# Altium project VENTUNOQ.PrjPcb (part 10 of 18)

## Sheet AUDIO_CODEC.SchDoc: AUDIO CODEC
size A3; Author: Silvio Navaretti; CompanyName: ARDUINO; DrawnBy: Silvio Navaretti; Engineer: Silvio Navaretti; Organization: ARDUINO; SheetNumber: 47; SheetTotal: 51; RevAuthor: Silvio Navaretti
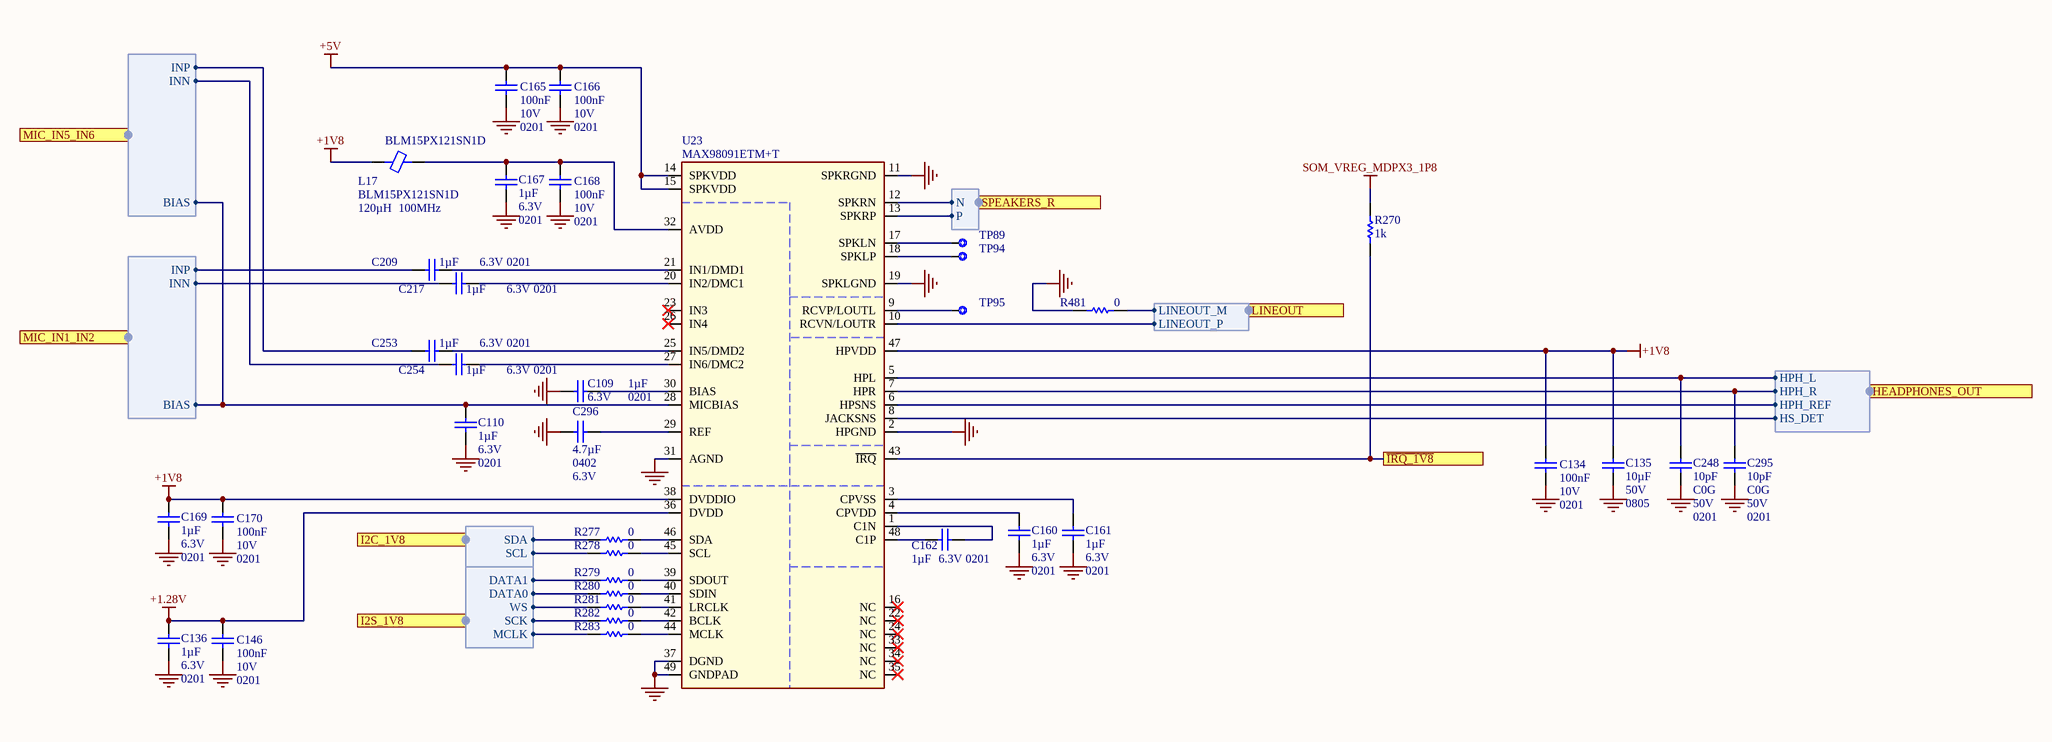
[diagram p25: AUDIO_CODEC.SchDoc]

### Parts
C109  value 1µF  Voltage: 6.3V  Case Code (Imperial): 0201  [CAP-0201]  (hidden comment: GRM033R60J105MEA2D)
C110  value 1µF  Voltage: 6.3V  Case Code (Imperial): 0201  [CAP-0201]  (hidden comment: GRM033R60J105MEA2D)
C134  value 100nF  Voltage: 10V  Case Code (Imperial): 0201  [CAP-0201]  (hidden comment: CL03A104KP3NNNC)
C135  value 10µF  Voltage: 50V  Case Code (Imperial): 0805  [CAP-0805]  (hidden comment: GRM21BR61H106ME43L)
C136  value 1µF  Voltage: 6.3V  Case Code (Imperial): 0201  [CAP-0201]  (hidden comment: GRM033R60J105MEA2D)
C146  value 100nF  Voltage: 10V  Case Code (Imperial): 0201  [CAP-0201]  (hidden comment: CL03A104KP3NNNC)
C160  value 1µF  Voltage: 6.3V  Case Code (Imperial): 0201  [CAP-0201]  (hidden comment: GRM033R60J105MEA2D)
C161  value 1µF  Voltage: 6.3V  Case Code (Imperial): 0201  [CAP-0201]  (hidden comment: GRM033R60J105MEA2D)
C162  value 1µF  Voltage: 6.3V  Case Code (Imperial): 0201  [CAP-0201]  (hidden comment: GRM033R60J105MEA2D)
C165  value 100nF  Voltage: 10V  Case Code (Imperial): 0201  [CAP-0201]  (hidden comment: CL03A104KP3NNNC)
C166  value 100nF  Voltage: 10V  Case Code (Imperial): 0201  [CAP-0201]  (hidden comment: CL03A104KP3NNNC)
C167  value 1µF  Voltage: 6.3V  Case Code (Imperial): 0201  [CAP-0201]  (hidden comment: GRM033R60J105MEA2D)
C168  value 100nF  Voltage: 10V  Case Code (Imperial): 0201  [CAP-0201]  (hidden comment: CL03A104KP3NNNC)
C169  value 1µF  Voltage: 6.3V  Case Code (Imperial): 0201  [CAP-0201]  (hidden comment: GRM033R60J105MEA2D)
C170  value 100nF  Voltage: 10V  Case Code (Imperial): 0201  [CAP-0201]  (hidden comment: CL03A104KP3NNNC)
C209  value 1µF  Voltage: 6.3V  Case Code (Imperial): 0201  [CAP-0201]  (hidden comment: GRM033R60J105MEA2D)
C217  value 1µF  Voltage: 6.3V  Case Code (Imperial): 0201  [CAP-0201]  (hidden comment: GRM033R60J105MEA2D)
C248  value 10pF  Dielectric: C0G  Voltage: 50V  Case Code (Imperial): 0201  [CAP-0201]  (hidden comment: CC0201GRNPO9BN100)
C253  value 1µF  Voltage: 6.3V  Case Code (Imperial): 0201  [CAP-0201]  (hidden comment: GRM033R60J105MEA2D)
C254  value 1µF  Voltage: 6.3V  Case Code (Imperial): 0201  [CAP-0201]  (hidden comment: GRM033R60J105MEA2D)
C295  value 10pF  Dielectric: C0G  Voltage: 50V  Case Code (Imperial): 0201  [CAP-0201]  (hidden comment: CC0201GRNPO9BN100)
C296  value 4.7µF  Case Code (Imperial): 0402  Voltage: 6.3V  [CAP-0402]  (hidden comment: C1005A475M6R3NT)
L17  BLM15PX121SN1D  Inductance: 120µH  Test Frequency: 100MHz  [L-0402]
R270  value 1k  [RES-0201]  (hidden comment: RC0201FR-071KL)
R277  value 0  [RES-0201]  (hidden comment: CRCW02010000Z0ED)
R278  value 0  [RES-0201]  (hidden comment: CRCW02010000Z0ED)
R279  value 0  [RES-0201]  (hidden comment: CRCW02010000Z0ED)
R280  value 0  [RES-0201]  (hidden comment: CRCW02010000Z0ED)
R281  value 0  [RES-0201]  (hidden comment: CRCW02010000Z0ED)
R282  value 0  [RES-0201]  (hidden comment: CRCW02010000Z0ED)
R283  value 0  [RES-0201]  (hidden comment: CRCW02010000Z0ED)
R481  value 0  [RES-0201]  (hidden comment: CRCW02010000Z0ED)
TP89  Test point 1.00mm  [TP-1.00MM]  (value not drawn)  (no BOM)
TP94  Test point 1.00mm  [TP-1.00MM]  (value not drawn)  (no BOM)
TP95  Test point 1.00mm  [TP-1.00MM]  (value not drawn)  (no BOM)
U23  MAX98091ETM+T  [QFN127P600-8N]

### Ports
HEADPHONES_OUT (harness HEADPHONES), I2C_1V8 (harness I2C), I2S_1V8 (harness SOM_MD_I2S_QUA), LINEOUT (harness LINEOUT), MIC_IN1_IN2 (harness MIC), MIC_IN5_IN6 (harness MIC), SPEAKERS_R (harness SPEAKERS), ~{IRQ_1V8}

### Harnesses
I2C: SDA, SCL
HEADPHONES: HPH_L, HPH_R, HPH_REF, HS_DET
MIC: INP, INN, BIAS
SPEAKERS: N, P
SOM_MD_I2S_QUA: SCK, WS, DATA0, DATA1, MCLK
LINEOUT: LINEOUT_P, LINEOUT_M

### Nets
+1.28V: C136.2 C146.2 U23.36(DVDD)
+1V8: C134.2 C135.1 C169.2 C170.2 L17.1 U23.38(DVDDIO) U23.47(HPVDD)
+5V: C165.2 C166.2 U23.14(SPKVDD) U23.15(SPKVDD)
GND: C109.1 C110.1 C134.1 C135.2 C136.1 C146.1 C160.1 C161.1 C165.1 C166.1 C167.1 C168.1 C169.1 C170.1 C248.1 C295.1 C296.2 R481.1 U23.2(HPGND) U23.11(SPKRGND) U23.19(SPKLGND) U23.31(AGND) U23.37(DGND) U23.49(GNDPAD)
SOM_VREG_MDPX3_1P8: R270.2
MD_GPIO_16: R270.1 U23.43(~{IRQ}) ; port ~{IRQ_1V8}
MD_GPIO_45: R277.1 ; port I2C_1V8.SDA
MD_GPIO_46: R278.1 ; port I2C_1V8.SCL
MD_LPASS_GPIO_110: R282.1 ; port I2S_1V8.SCK
MD_LPASS_GPIO_111: R281.1 ; port I2S_1V8.WS
MD_LPASS_GPIO_112: R280.1 ; port I2S_1V8.DATA0
MD_LPASS_GPIO_113: R279.1 ; port I2S_1V8.DATA1
MD_LPASS_GPIO_115: R283.1 ; port I2S_1V8.MCLK
MIC_IN5_IN6.BIAS: C110.2 U23.28(MICBIAS) ; port MIC_IN1_IN2.BIAS, port MIC_IN5_IN6.BIAS
MIC_IN5_IN6.INN: C254.2 ; port MIC_IN5_IN6.INN
MIC_IN5_IN6.INP: C253.2 ; port MIC_IN5_IN6.INP
NetC109_2: C109.2 U23.30(BIAS)
NetC160_2: C160.2 U23.4(CPVDD)
NetC161_2: C161.2 U23.3(CPVSS)
NetC162_1: C162.1 U23.1(C1N)
NetC162_2: C162.2 U23.48(C1P)
NetC167_2: C167.2 C168.2 L17.2 U23.32(AVDD)
NetC209_1: C209.1 U23.21(IN1/DMD1)
NetC209_2: C209.2 ; port MIC_IN1_IN2.INP
NetC217_1: C217.1 U23.20(IN2/DMC1)
NetC217_2: C217.2 ; port MIC_IN1_IN2.INN
NetC248_2: C248.2 U23.5(HPL) ; port HEADPHONES_OUT.HPH_L
NetC253_1: C253.1 U23.25(IN5/DMD2)
NetC254_1: C254.1 U23.27(IN6/DMC2)
NetC295_2: C295.2 U23.7(HPR) ; port HEADPHONES_OUT.HPH_R
NetC296_1: C296.1 U23.29(REF)
NetD103_1: U23.13(SPKRP) ; port SPEAKERS_R.P
NetD103_2: U23.12(SPKRN) ; port SPEAKERS_R.N
NetD103_4: U23.10(RCVN/LOUTR) ; port LINEOUT.LINEOUT_P
NetD103_5: R481.2 ; port LINEOUT.LINEOUT_M
NetD104_4: U23.6(HPSNS) ; port HEADPHONES_OUT.HPH_REF
NetD104_5: U23.8(JACKSNS) ; port HEADPHONES_OUT.HS_DET
NetR277_2: R277.2 U23.46(SDA)
NetR278_2: R278.2 U23.45(SCL)
NetR279_2: R279.2 U23.39(SDOUT)
NetR280_2: R280.2 U23.40(SDIN)
NetR281_2: R281.2 U23.41(LRCLK)
NetR282_2: R282.2 U23.42(BCLK)
NetR283_2: R283.2 U23.44(MCLK)
NetTP89_X: TP89.X U23.17(SPKLN)
NetTP94_X: TP94.X U23.18(SPKLP)
NetTP95_X: TP95.X U23.9(RCVP/LOUTL)

Not connected (* = marked no-connect by the designer): U23 16(NC)* 22(NC)* 23(IN3)* 24(NC)* 26(IN4)* 33(NC)* 34(NC)* 35(NC)*

### Notes on the sheet
- Title:
- ID:
- Date:
- Time:
- Version:
- Sheet
- of
- RevAuthor:
- Reference Designs ARE PROVIDED "AS IS" AND "WITH ALL FAULTS. Arduino SA DISCLAIMS ALL OTHER WARRANTIES, EXPRESS OR IMPLIED, REGARDING PRODUCTS, INCLUDING BUT NOT LIMITED TO, ANY IMPLIED WARRANTIES OF MERCHANTABILITY OR FITNESS FOR A PARTICULAR PURPOSE.
  Arduino SA may make changes to specifications and product descriptions at any time, without notice. The Customer must not rely on the absence or characteristics of any features or instructions marked "reserved" or "undefined".
  Arduino SA reserves these for future definition and shall have no responsibility whatsoever for conflicts or incompatibilities arising from future changes to them. The product information on the Web Site or Materials is subject to change without notice.
  Do not finalize a design with this info. ARDUINO and other Arduino brands and logos and Trademarks of Arduino SA. All Arduino SA Trademarks cannot be used without owner's formal permission.
- File:
- Author:

### Library data of the parts
C109 C110 C136 C160-C162 C167 C169 C209 C217 C253 C254 = C0002-A.15: CAP CHIP 0201 1uF 20% 6.3V X5R; Manufacturer: Murata; Code Arduino: A5520; Tolerance: 20%; Dielectric: X5R; Part Number: GRM033R60J105MEA2D; Technology: Ceramic
C134 C146 C165 C166 C168 C170 = C0113-A.6: CAP CHIP 0201 100nF 10% 10V X5R; Manufacturer: Samsung Electro-Mechanics; Code Arduino: C0113; Technology: Ceramic; Part Number: CL03A104KP3NNNC; Dielectric: X5R; Tolerance: 10%
C135 = C0158-A.3: CAP CHIP 0805 10uF 20% 50V X5R; Manufacturer: Murata Electronics; Code Arduino: C0158; Technology: SMD; Dielectric: X5R; Tolerance: 20%; Part Number: GRM21BR61H106ME43L
C248 C295 = C0144-A.3: CAP CHIP 0201 10pF 5% 50V C0G; Manufacturer: Yageo; Code Arduino: C0144; Price: 0.005; Technology: Ceramic; Tolerance: 5%; Part Number: CC0201GRNPO9BN100
C296 = C0037-A.14: CAP CHIP 0402 4.7uF 20% 6V3 X5R; Manufacturer: Hottech; Code Arduino: 0833; Dielectric: X5R; Technology: Ceramic; Part Number: C1005A475M6R3NT; Manufacturer 2: Samsung Electro-Mechanics; Tolerance: 20%; Manufacturer 3: Murata Electronics; Part number 3: GRM155R60J475ME47D; Part number 2: CL05A475KQ5NRNC
L17 = I0028-A.10: FERRITE SMD 0402 120Ohm 25% 100MHz Ferrite 2A; Manufacturer: Murata; DC Resistance (DCR): 55mR; Code Arduino: I0028; Value: 120µH; Device Type: Ferrite; Packaging: Tape and Reel; Case Code (Imperial): 0402; Max DC Current: 2A; Case Code (Metric): 1005; Package Quantity: 10000; Current: 2A; Max Operating Temperature: 125°C; Tolerance: 25%; Min Operating Temperature: -55°C; Part Number: BLM15PX121SN1D
R270 = R0195-A.22: RES CHIP 0201 1k 1% 1/20W; Manufacturer: Yageo; Power: 50mW; Temperature coefficient: 200ppm; Code Arduino: R0195; Tolerance: 1%; Case Code (Imperial): 0201; Part Number: RC0201FR-071KL; Technology: Thick film
R277-R283 R481 = R0140-A.21: RES CHIP 0201 0R; Manufacturer: Vishay; Temperature coefficient: 0ppm; Code Arduino: R0140; Power: 50mW; Tolerance: 0%; Technology: Thick film; Case Code (Imperial): 0201; Part Number: CRCW02010000Z0ED
TP89 TP94 TP95 = UT0013-A.6: Part Number: This is not a component; Design Item ID: CMP-018-0005-A.3; Source: ut.SchLib; Manufacturer: This is not a component; Code Arduino: This is not a component; Pin Count: 1
U23 = U0313-A.5: CODEC Audio CODEC, 4 IN microphone, stereo speaker out 3.2W, stereo headphone out, line output, I2C+I2S, QFN48 6x6; Manufacturer: Analog Devices; Code Arduino: U0313; Part Number: MAX98091ETM+T

## Sheet HEADERS_JHAT.SchDoc: HEADERS JHAT
size A3; Author: Silvio Navaretti; CompanyName: ARDUINO; DrawnBy: Silvio Navaretti; Engineer: Silvio Navaretti; Organization: ARDUINO; SheetNumber: 20; SheetTotal: 51; RevAuthor: Silvio Navaretti
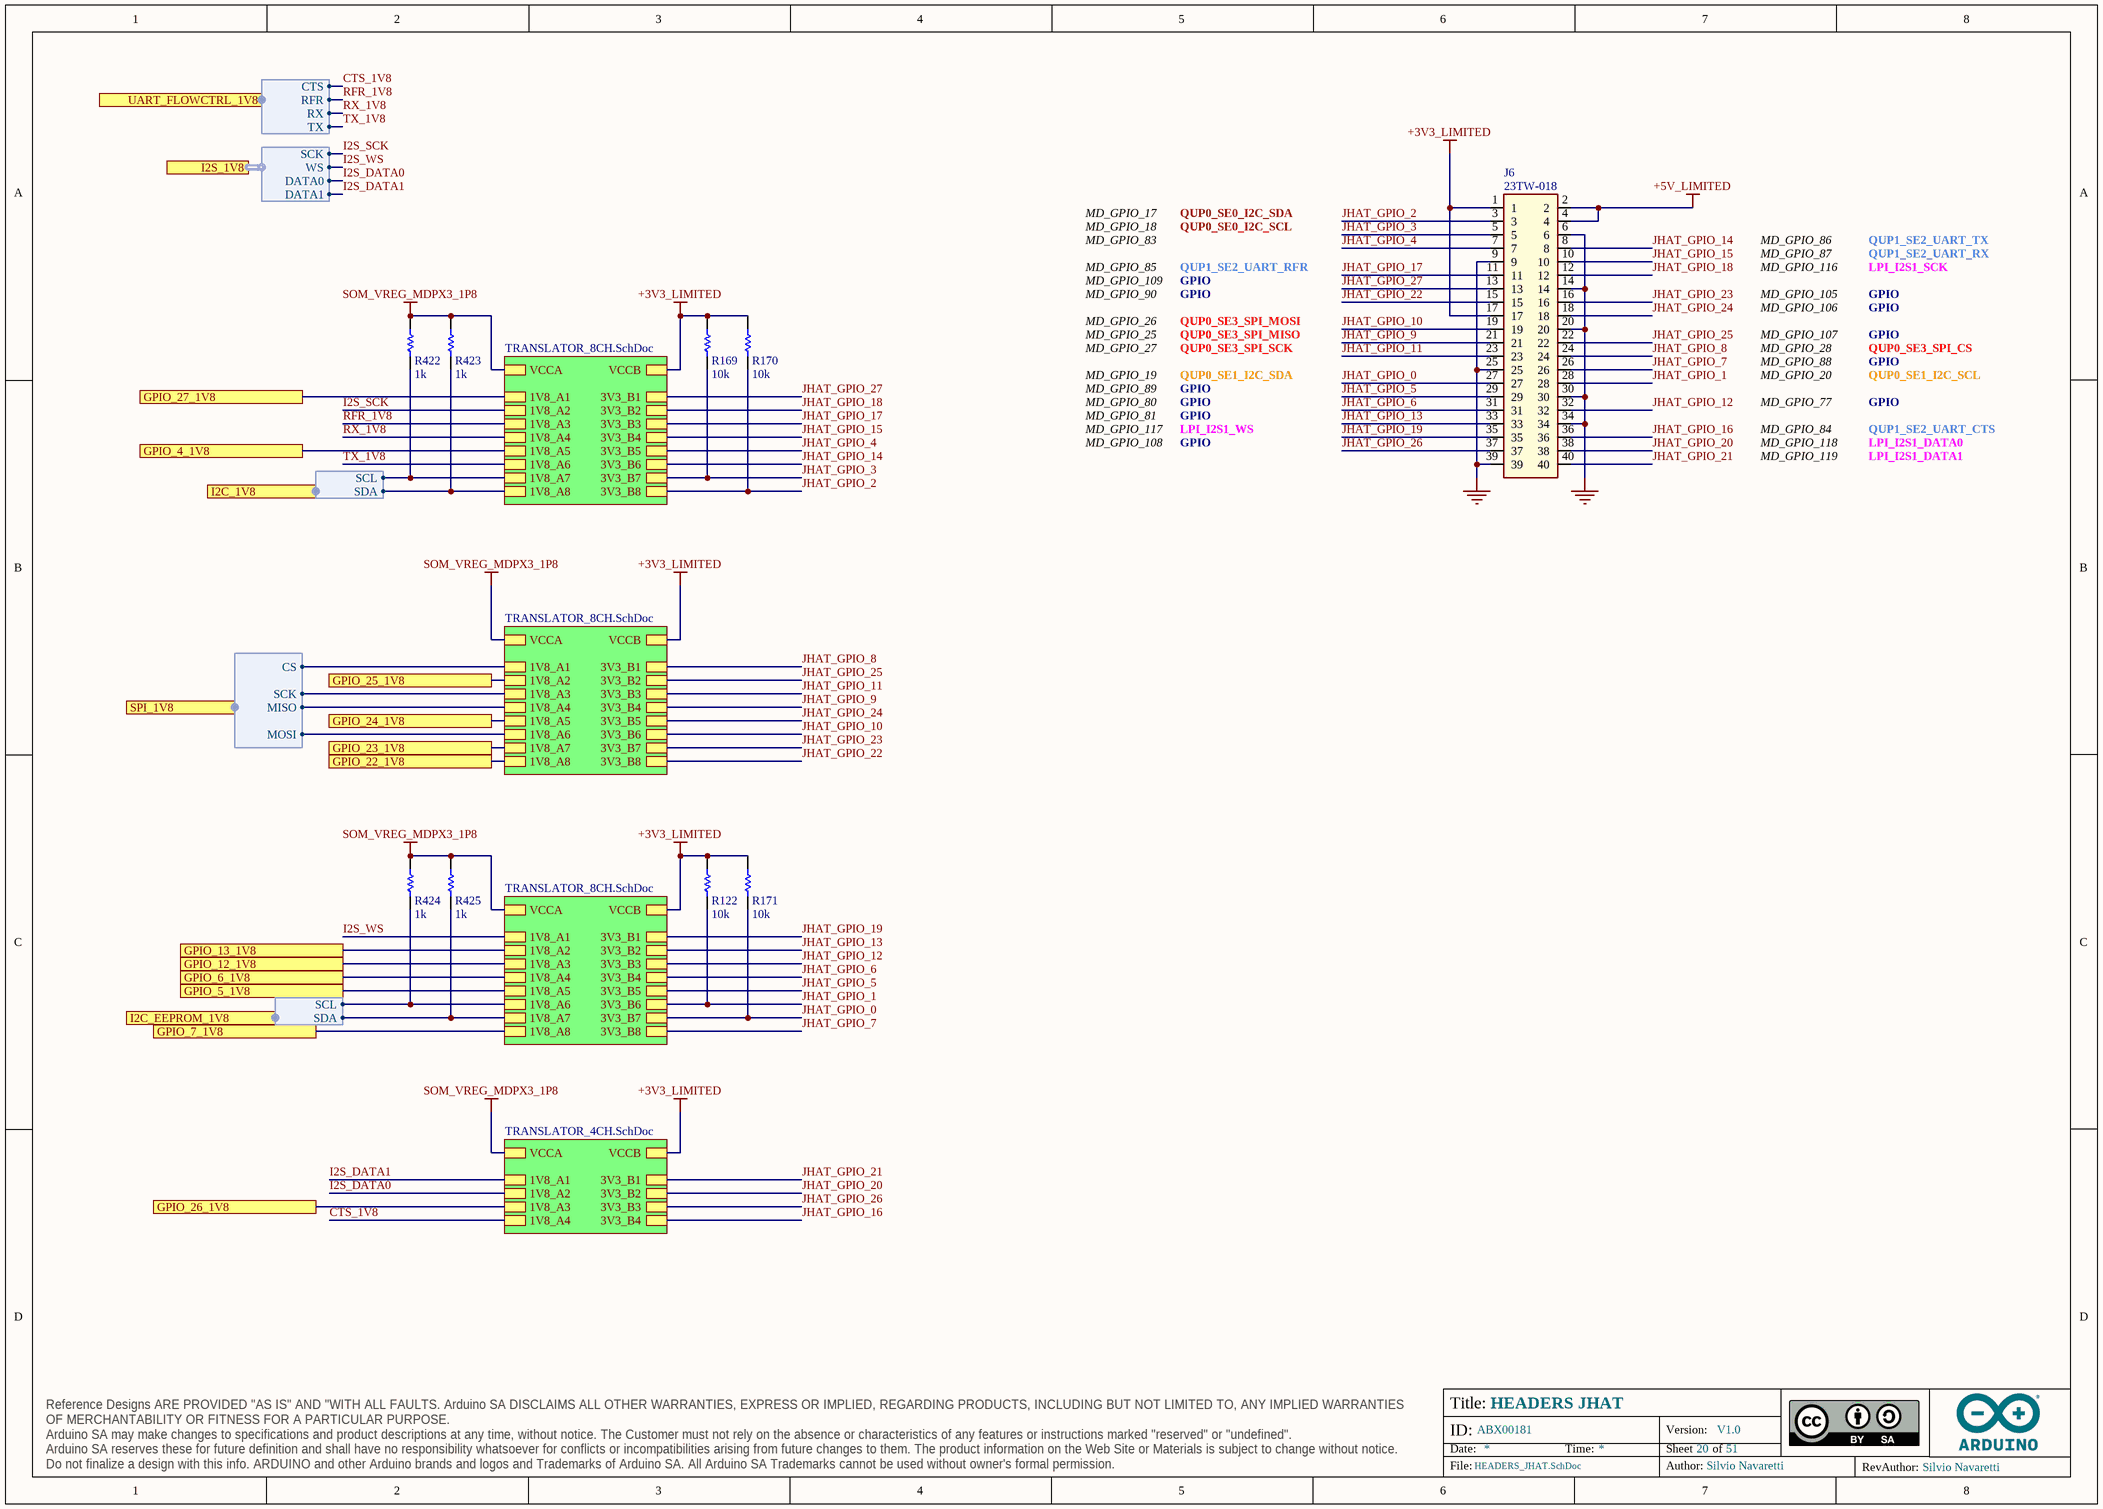
[diagram p26: HEADERS_JHAT.SchDoc]

### Parts
J6  23TW-018  [23TW-018]
R122  value 10k  [RES-0201]  (hidden comment: RC0201FR-0710KL)
R169  value 10k  [RES-0201]  (hidden comment: RC0201FR-0710KL)
R170  value 10k  [RES-0201]  (hidden comment: RC0201FR-0710KL)
R171  value 10k  [RES-0201]  (hidden comment: RC0201FR-0710KL)
R422  value 1k  [RES-0201]  (hidden comment: RC0201FR-071KL)
R423  value 1k  [RES-0201]  (hidden comment: RC0201FR-071KL)
R424  value 1k  [RES-0201]  (hidden comment: RC0201FR-071KL)
R425  value 1k  [RES-0201]  (hidden comment: RC0201FR-071KL)

### Sub-sheets
T8CH_ = TRANSLATOR_8CH.SchDoc: 1V8_A1, 1V8_A2, 1V8_A3, 1V8_A4, 1V8_A5, 1V8_A6, 1V8_A7, 1V8_A8, 3V3_B1, 3V3_B2, 3V3_B3, 3V3_B4, 3V3_B5, 3V3_B6, 3V3_B7, VCCA, VCCB, 3V3_B8
T8CH_ = TRANSLATOR_8CH.SchDoc: 1V8_A1, 1V8_A2, 1V8_A3, 1V8_A4, 1V8_A5, 1V8_A6, 1V8_A7, 1V8_A8, 3V3_B1, 3V3_B2, 3V3_B3, 3V3_B4, 3V3_B5, 3V3_B6, 3V3_B7, 3V3_B8, VCCA, VCCB
T8CH_ = TRANSLATOR_8CH.SchDoc: 1V8_A1, 1V8_A2, 1V8_A3, 1V8_A4, 1V8_A5, 1V8_A6, 1V8_A7, 1V8_A8, 3V3_B1, 3V3_B2, 3V3_B3, 3V3_B4, 3V3_B5, 3V3_B6, 3V3_B7, 3V3_B8, VCCA, VCCB
U_TRANSLATOR_4CH = TRANSLATOR_4CH.SchDoc: 1V8_A1, 1V8_A2, 1V8_A3, 1V8_A4, 3V3_B1, 3V3_B2, 3V3_B3, 3V3_B4, VCCA, VCCB

### Ports
GPIO_4_1V8, GPIO_5_1V8, GPIO_6_1V8, GPIO_7_1V8, GPIO_12_1V8, GPIO_13_1V8, GPIO_22_1V8, GPIO_23_1V8, GPIO_24_1V8, GPIO_25_1V8, GPIO_26_1V8, GPIO_27_1V8, I2C_1V8 (harness I2C), I2C_EEPROM_1V8 (harness I2C), I2S_1V8 (harness SOM_MD_I2S), SPI_1V8 (harness SPI), UART_FLOWCTRL_1V8 (harness SOM_MD_UART_FLCRTL)

### Harnesses
I2C: SDA, SCL
SPI: SCK, MISO, MOSI, CS
SOM_MD_UART_FLCRTL: TX, CTS, RFR, RX
SOM_MD_I2S: SCK, WS, DATA0, DATA1

### Nets
+3V3_LIMITED: J6.1 J6.17 R122.1 R169.1 R170.1 R171.1 ; sheet T8CH_/VCCB, sheet T8CH_/VCCB, sheet T8CH_/VCCB, sheet U_TRANSLATOR_4CH/VCCB
+5V_LIMITED: J6.2 J6.4
GND: J6.6 J6.9 J6.14 J6.20 J6.25 J6.30 J6.34 J6.39
SOM_VREG_MDPX3_1P8: R422.1 R423.1 R424.1 R425.1 ; sheet T8CH_/VCCA, sheet T8CH_/VCCA, sheet T8CH_/VCCA, sheet U_TRANSLATOR_4CH/VCCA
CTS_1V8: sheet U_TRANSLATOR_4CH/1V8_A4, port UART_FLOWCTRL_1V8.CTS
I2S_DATA0: sheet U_TRANSLATOR_4CH/1V8_A2, port I2S_1V8.DATA0
I2S_DATA1: sheet U_TRANSLATOR_4CH/1V8_A1, port I2S_1V8.DATA1
I2S_SCK: sheet T8CH_/1V8_A2, port I2S_1V8.SCK
I2S_WS: sheet T8CH_/1V8_A1, port I2S_1V8.WS
JHAT_GPIO_0: J6.27 R171.2 ; sheet T8CH_/3V3_B7
JHAT_GPIO_1: J6.28 R122.2 ; sheet T8CH_/3V3_B6
JHAT_GPIO_2: J6.3 R170.2 ; sheet T8CH_/3V3_B8
JHAT_GPIO_3: J6.5 R169.2 ; sheet T8CH_/3V3_B7
JHAT_GPIO_4: J6.7 ; sheet T8CH_/3V3_B5
JHAT_GPIO_5: J6.29 ; sheet T8CH_/3V3_B5
JHAT_GPIO_6: J6.31 ; sheet T8CH_/3V3_B4
JHAT_GPIO_7: J6.26 ; sheet T8CH_/3V3_B8
JHAT_GPIO_8: J6.24 ; sheet T8CH_/3V3_B1
JHAT_GPIO_9: J6.21 ; sheet T8CH_/3V3_B4
JHAT_GPIO_10: J6.19 ; sheet T8CH_/3V3_B6
JHAT_GPIO_11: J6.23 ; sheet T8CH_/3V3_B3
JHAT_GPIO_12: J6.32 ; sheet T8CH_/3V3_B3
JHAT_GPIO_13: J6.33 ; sheet T8CH_/3V3_B2
JHAT_GPIO_14: J6.8 ; sheet T8CH_/3V3_B6
JHAT_GPIO_15: J6.10 ; sheet T8CH_/3V3_B4
JHAT_GPIO_16: J6.36 ; sheet U_TRANSLATOR_4CH/3V3_B4
JHAT_GPIO_17: J6.11 ; sheet T8CH_/3V3_B3
JHAT_GPIO_18: J6.12 ; sheet T8CH_/3V3_B2
JHAT_GPIO_19: J6.35 ; sheet T8CH_/3V3_B1
JHAT_GPIO_20: J6.38 ; sheet U_TRANSLATOR_4CH/3V3_B2
JHAT_GPIO_21: J6.40 ; sheet U_TRANSLATOR_4CH/3V3_B1
JHAT_GPIO_22: J6.15 ; sheet T8CH_/3V3_B8
JHAT_GPIO_23: J6.16 ; sheet T8CH_/3V3_B7
JHAT_GPIO_24: J6.18 ; sheet T8CH_/3V3_B5
JHAT_GPIO_25: J6.22 ; sheet T8CH_/3V3_B2
JHAT_GPIO_26: J6.37 ; sheet U_TRANSLATOR_4CH/3V3_B3
JHAT_GPIO_27: J6.13 ; sheet T8CH_/3V3_B1
MD_GPIO_17: R423.2 ; sheet T8CH_/1V8_A8, port I2C_1V8.SDA
MD_GPIO_18: R422.2 ; sheet T8CH_/1V8_A7, port I2C_1V8.SCL
MD_GPIO_19: R425.2 ; sheet T8CH_/1V8_A7, port I2C_EEPROM_1V8.SDA
MD_GPIO_20: R424.2 ; sheet T8CH_/1V8_A6, port I2C_EEPROM_1V8.SCL
MD_GPIO_25: sheet T8CH_/1V8_A4, port SPI_1V8.MISO
MD_GPIO_26: sheet T8CH_/1V8_A6, port SPI_1V8.MOSI
MD_GPIO_27: sheet T8CH_/1V8_A3, port SPI_1V8.SCK
MD_GPIO_28: sheet T8CH_/1V8_A1, port SPI_1V8.CS
MD_GPIO_77: port GPIO_12_1V8, sheet T8CH_/1V8_A3
MD_GPIO_80: port GPIO_6_1V8, sheet T8CH_/1V8_A4
MD_GPIO_81: port GPIO_13_1V8, sheet T8CH_/1V8_A2
MD_GPIO_83: port GPIO_4_1V8, sheet T8CH_/1V8_A5
MD_GPIO_88: port GPIO_7_1V8, sheet T8CH_/1V8_A8
MD_GPIO_89: port GPIO_5_1V8, sheet T8CH_/1V8_A5
MD_GPIO_90: port GPIO_22_1V8, sheet T8CH_/1V8_A8
MD_GPIO_105: port GPIO_23_1V8, sheet T8CH_/1V8_A7
MD_GPIO_106: port GPIO_24_1V8, sheet T8CH_/1V8_A5
MD_GPIO_107: port GPIO_25_1V8, sheet T8CH_/1V8_A2
MD_GPIO_108: port GPIO_26_1V8, sheet U_TRANSLATOR_4CH/1V8_A3
MD_GPIO_109: port GPIO_27_1V8, sheet T8CH_/1V8_A1
RFR_1V8: sheet T8CH_/1V8_A3, port UART_FLOWCTRL_1V8.RFR  [project net MD_GPIO_85]
RX_1V8: sheet T8CH_/1V8_A4, port UART_FLOWCTRL_1V8.RX  [project net MD_GPIO_87]
TX_1V8: sheet T8CH_/1V8_A6, port UART_FLOWCTRL_1V8.TX  [project net MD_GPIO_86]

### Notes on the sheet
- MD_GPIO_17
- MD_GPIO_18
- MD_GPIO_83
- QUP0_SE0_I2C_SDA
- QUP0_SE0_I2C_SCL
- MD_GPIO_86
- QUP1_SE2_UART_TX
- MD_GPIO_85
- MD_GPIO_109
- MD_GPIO_90
- QUP1_SE2_UART_RFR
- GPIO
- MD_GPIO_87
- MD_GPIO_116
- MD_GPIO_105
- MD_GPIO_106
- QUP1_SE2_UART_RX
- LPI_I2S1_SCK
- MD_GPIO_26
- MD_GPIO_25
- MD_GPIO_27
- MD_GPIO_19
- QUP0_SE3_SPI_MOSI
- QUP0_SE3_SPI_MISO
- QUP0_SE3_SPI_SCK
- QUP0_SE1_I2C_SDA
- MD_GPIO_107
- MD_GPIO_28
- MD_GPIO_88
- MD_GPIO_20
- QUP0_SE3_SPI_CS
- QUP0_SE1_I2C_SCL
- MD_GPIO_89
- MD_GPIO_80
- MD_GPIO_81
- MD_GPIO_117
- MD_GPIO_108
- LPI_I2S1_WS
- MD_GPIO_77
- MD_GPIO_84
- MD_GPIO_118
- QUP1_SE2_UART_CTS
- LPI_I2S1_DATA0
- MD_GPIO_119
- LPI_I2S1_DATA1
- Title:
- ID:
- Date:
- Time:
- Version:
- Sheet
- of
- RevAuthor:
- Reference Designs ARE PROVIDED "AS IS" AND "WITH ALL FAULTS. Arduino SA DISCLAIMS ALL OTHER WARRANTIES, EXPRESS OR IMPLIED, REGARDING PRODUCTS, INCLUDING BUT NOT LIMITED TO, ANY IMPLIED WARRANTIES OF MERCHANTABILITY OR FITNESS FOR A PARTICULAR PURPOSE.
  Arduino SA may make changes to specifications and product descriptions at any time, without notice. The Customer must not rely on the absence or characteristics of any features or instructions marked "reserved" or "undefined".
  Arduino SA reserves these for future definition and shall have no responsibility whatsoever for conflicts or incompatibilities arising from future changes to them. The product information on the Web Site or Materials is subject to change without notice.
  Do not finalize a design with this info. ARDUINO and other Arduino brands and logos and Trademarks of Arduino SA. All Arduino SA Trademarks cannot be used without owner's formal permission.
- File:
- Author:

### Library data of the parts
J6 = J0572-A.1: CONN HEADER MALE 40POS 2x20 2.54mm SMD 6mm pin length; Manufacturer: 4UCONN; Code Arduino: J0572; Connector Type: BOARD CONNECTOR; Number of Contacts: 40; Part Number: 23TW-018; Termination: SMD/SMT; Insulation Color: Black; Contact Material: Gold
R122 R169-R171 = R0145-A.21: RES CHIP 0201 10k 1% 1/20W; Manufacturer: Yageo; Power: 50mW; Temperature coefficient: 200ppm; Code Arduino: R0145; Manufacturer 2: Samsung Electro-Mechanics; Tolerance: 1%; Case Code (Imperial): 0201; Part Number: RC0201FR-0710KL; Technology: Thick film
R422-R425 = R0195-A.22: as R270 on sheet AUDIO_CODEC; Tolerance: 1%; Case Code (Imperial): 0201; Part Number: RC0201FR-071KL; Technology: Thick film

## Sheet TRANSLATOR_4CH.SchDoc: TRANSLATOR 4CH
size A4; Author: Silvio Navaretti; CompanyName: ARDUINO; DrawnBy: Silvio Navaretti; Engineer: Silvio Navaretti; Organization: ARDUINO; SheetNumber: 18; SheetTotal: 51; RevAuthor: Silvio Navaretti
Used 5 times, as channels U_HEADERS_JHAT/U_TRANSLATOR_4CH, U_MIPI/U_TRANSLATOR_4CH, U_MICROCONTROLLER/U_TRANSLATOR_4CH, U_PCIE/U_WIFI_BLE/U_TRANSLATOR_4CH, U_PCIE/U_TRANSLATOR_4CH. Parts and nets are listed once, with the designators drawn on the sheet.
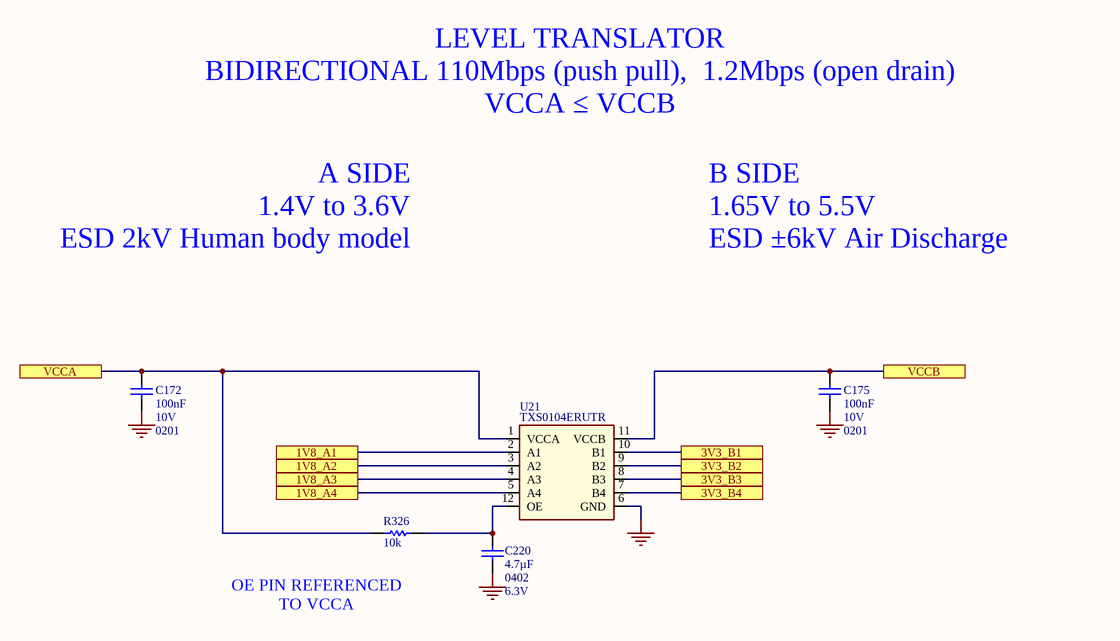
[diagram p27: TRANSLATOR_4CH.SchDoc]

### Parts
C172  value 100nF  Voltage: 10V  Case Code (Imperial): 0201  [CAP-0201]  (hidden comment: CL03A104KP3NNNC)
C175  value 100nF  Voltage: 10V  Case Code (Imperial): 0201  [CAP-0201]  (hidden comment: CL03A104KP3NNNC)
C220  value 4.7µF  Case Code (Imperial): 0402  Voltage: 6.3V  [CAP-0402]  (hidden comment: C1005A475M6R3NT)
R326  value 10k  [RES-0201]  (hidden comment: RC0201FR-0710KL)
U21  TXS0104ERUTR  [TI RUT RUT0012A UQFN 2x1.7x0.55mm 12 pins 0.4mm pitch]

### Ports
1V8_A1, 1V8_A2, 1V8_A3, 1V8_A4, 3V3_B1, 3V3_B2, 3V3_B3, 3V3_B4, VCCA, VCCB

### Nets
GND: C172.1 C175.1 C220.2 U21.6(GND)
1V8_A1: U21.2(A1) ; port 1V8_A1
1V8_A2: U21.3(A2) ; port 1V8_A2
1V8_A3: U21.4(A3) ; port 1V8_A3
1V8_A4: U21.5(A4) ; port 1V8_A4
3V3_B1: U21.10(B1) ; port 3V3_B1
3V3_B2: U21.9(B2) ; port 3V3_B2
3V3_B3: U21.8(B3) ; port 3V3_B3
3V3_B4: U21.7(B4) ; port 3V3_B4
VCCA: C172.2 R326.2 U21.1(VCCA) ; port VCCA
VCCB: C175.2 U21.11(VCCB) ; port VCCB
NetC220_1: C220.1 R326.1 U21.12(OE)

### Channels
U_HEADERS_JHAT/U_TRANSLATOR_4CH: designators end in _1; ports 1V8_A1=I2S_DATA1 1V8_A2=I2S_DATA0 1V8_A3=MD_GPIO_108 1V8_A4=CTS_1V8 3V3_B1=JHAT_GPIO_21 3V3_B2=JHAT_GPIO_20 3V3_B3=JHAT_GPIO_26 3V3_B4=JHAT_GPIO_16 VCCA=SOM_VREG_MDPX3_1P8 VCCB=+3V3_LIMITED
U_MIPI/U_TRANSLATOR_4CH: designators end in _2; ports 1V8_A1=MD_GPIO_64 1V8_A2=MD_GPIO_75 1V8_A3=MD_GPIO_82 1V8_A4=NetR396_2 3V3_B1=FLAT0_GPIO_PIN17_3V3 3V3_B2=FLAT1_GPIO_PIN17_3V3 3V3_B3=FLAT2_GPIO_PIN17_3V3 3V3_B4=NetR395_1 VCCA=SOM_VREG_MDPX3_1P8 VCCB=+3V3
U_MICROCONTROLLER/U_TRANSLATOR_4CH: designators end in _3; ports 1V8_A1=NetR361_1 1V8_A2=NetR362_1 1V8_A3=NetR363_1 1V8_A4=NetR364_1 3V3_B1=NetR140_2 3V3_B2=NetR151_2 3V3_B3=NetR152_2 3V3_B4=NetR153_2 VCCA=SOM_VREG_MDPX3_1P8 VCCB=+3V3
U_PCIE/U_WIFI_BLE/U_TRANSLATOR_4CH: designators end in _4; ports 1V8_A1=NetR465_1 1V8_A2=NetR23_1 1V8_A3=NetR461_2 1V8_A4=NetR429_2 3V3_B1=NetR464_2 3V3_B2=NetR463_2 3V3_B3=NetR24_2 3V3_B4=NetR428_2 VCCA=SOM_VREG_MDPX3_1P8 VCCB=+3V3
U_PCIE/U_TRANSLATOR_4CH: designators end in _5; ports 1V8_A1=GPIO_0 1V8_A2=CLKREQ_N_1V8 1V8_A3=GPIO_2 1V8_A4=NetR315_2 3V3_B1=WAKE_N_3V3 3V3_B2=CLKREQ_N_3V3 3V3_B3=RST_N_3V3 3V3_B4=NetR323_2 VCCA=SOM_VREG_MDPX3_1P8 VCCB=+3V3

### Notes on the sheet
- LEVEL TRANSLATOR
  BIDIRECTIONAL 110Mbps (push pull),  1.2Mbps (open drain)
  VCCA ≤ VCCB
- A SIDE
  1.4V to 3.6V
  ESD 2kV Human body model
- B SIDE
  1.65V to 5.5V
  ESD ±6kV Air Discharge
- (near R326) OE PIN REFERENCED TO VCCA
- Title:
- ID:
- Date:
- Time:
- Version:
- Sheet
- of
- RevAuthor:
- Reference Designs ARE PROVIDED "AS IS" AND "WITH ALL FAULTS. Arduino SA DISCLAIMS ALL OTHER WARRANTIES, EXPRESS OR IMPLIED, REGARDING PRODUCTS, INCLUDING BUT NOT LIMITED TO, ANY IMPLIED WARRANTIES OF MERCHANTABILITY OR FITNESS FOR A PARTICULAR PURPOSE.
  Arduino SA may make changes to specifications and product descriptions at any time, without notice. The Customer must not rely on the absence or characteristics of any features or instructions marked "reserved" or "undefined". Arduino SA reserves these for future definition and shall have no responsibility whatsoever for conflicts or incompatibilities arising from future changes to them. The product information on the Web Site or Materials is subject to change without notice.
  Do not finalize a design with this info. ARDUINO and other Arduino brands and logos and Trademarks of Arduino SA. All Arduino SA Trademarks cannot be used without owner's formal permission.
- File:
- Author:

### Library data of the parts
C172 C175 = C0113-A.6: as C134 on sheet AUDIO_CODEC; Technology: Ceramic; Part Number: CL03A104KP3NNNC; Dielectric: X5R; Tolerance: 10%
C220 = C0037-A.14: as C296 on sheet AUDIO_CODEC; Dielectric: X5R; Technology: Ceramic; Part Number: C1005A475M6R3NT; Manufacturer 2: Samsung Electro-Mechanics; Tolerance: 20%; Manufacturer 3: Murata Electronics; Part number 3: GRM155R60J475ME47D; Part number 2: CL05A475KQ5NRNC
R326 = R0145-A.21: as R122 on sheet HEADERS_JHAT; Manufacturer 2: Samsung Electro-Mechanics; Tolerance: 1%; Case Code (Imperial): 0201; Part Number: RC0201FR-0710KL; Technology: Thick film
U21 = U0523-A.1: IC TRANSLATOR LEVEL SHIFTER BIDIR 4b, push pull 110Mbps, open drain 1.2Mbps, VCCA 1.4V-3.6V, VCCB 1.6V-5.5V, VCCA≤VCCB, Output Enable, UQFN-12 2x1.7mm; Manufacturer: Texas Instruments; Code Arduino: U0523; Part Number: TXS0104ERUTR

## Sheet VIDEO.SchDoc: VIDEO
size A3; Author: Silvio Navaretti; CompanyName: ARDUINO; DrawnBy: Silvio Navaretti; Engineer: Silvio Navaretti; Organization: ARDUINO; SheetNumber: 41; SheetTotal: 51; RevAuthor: Silvio Navaretti
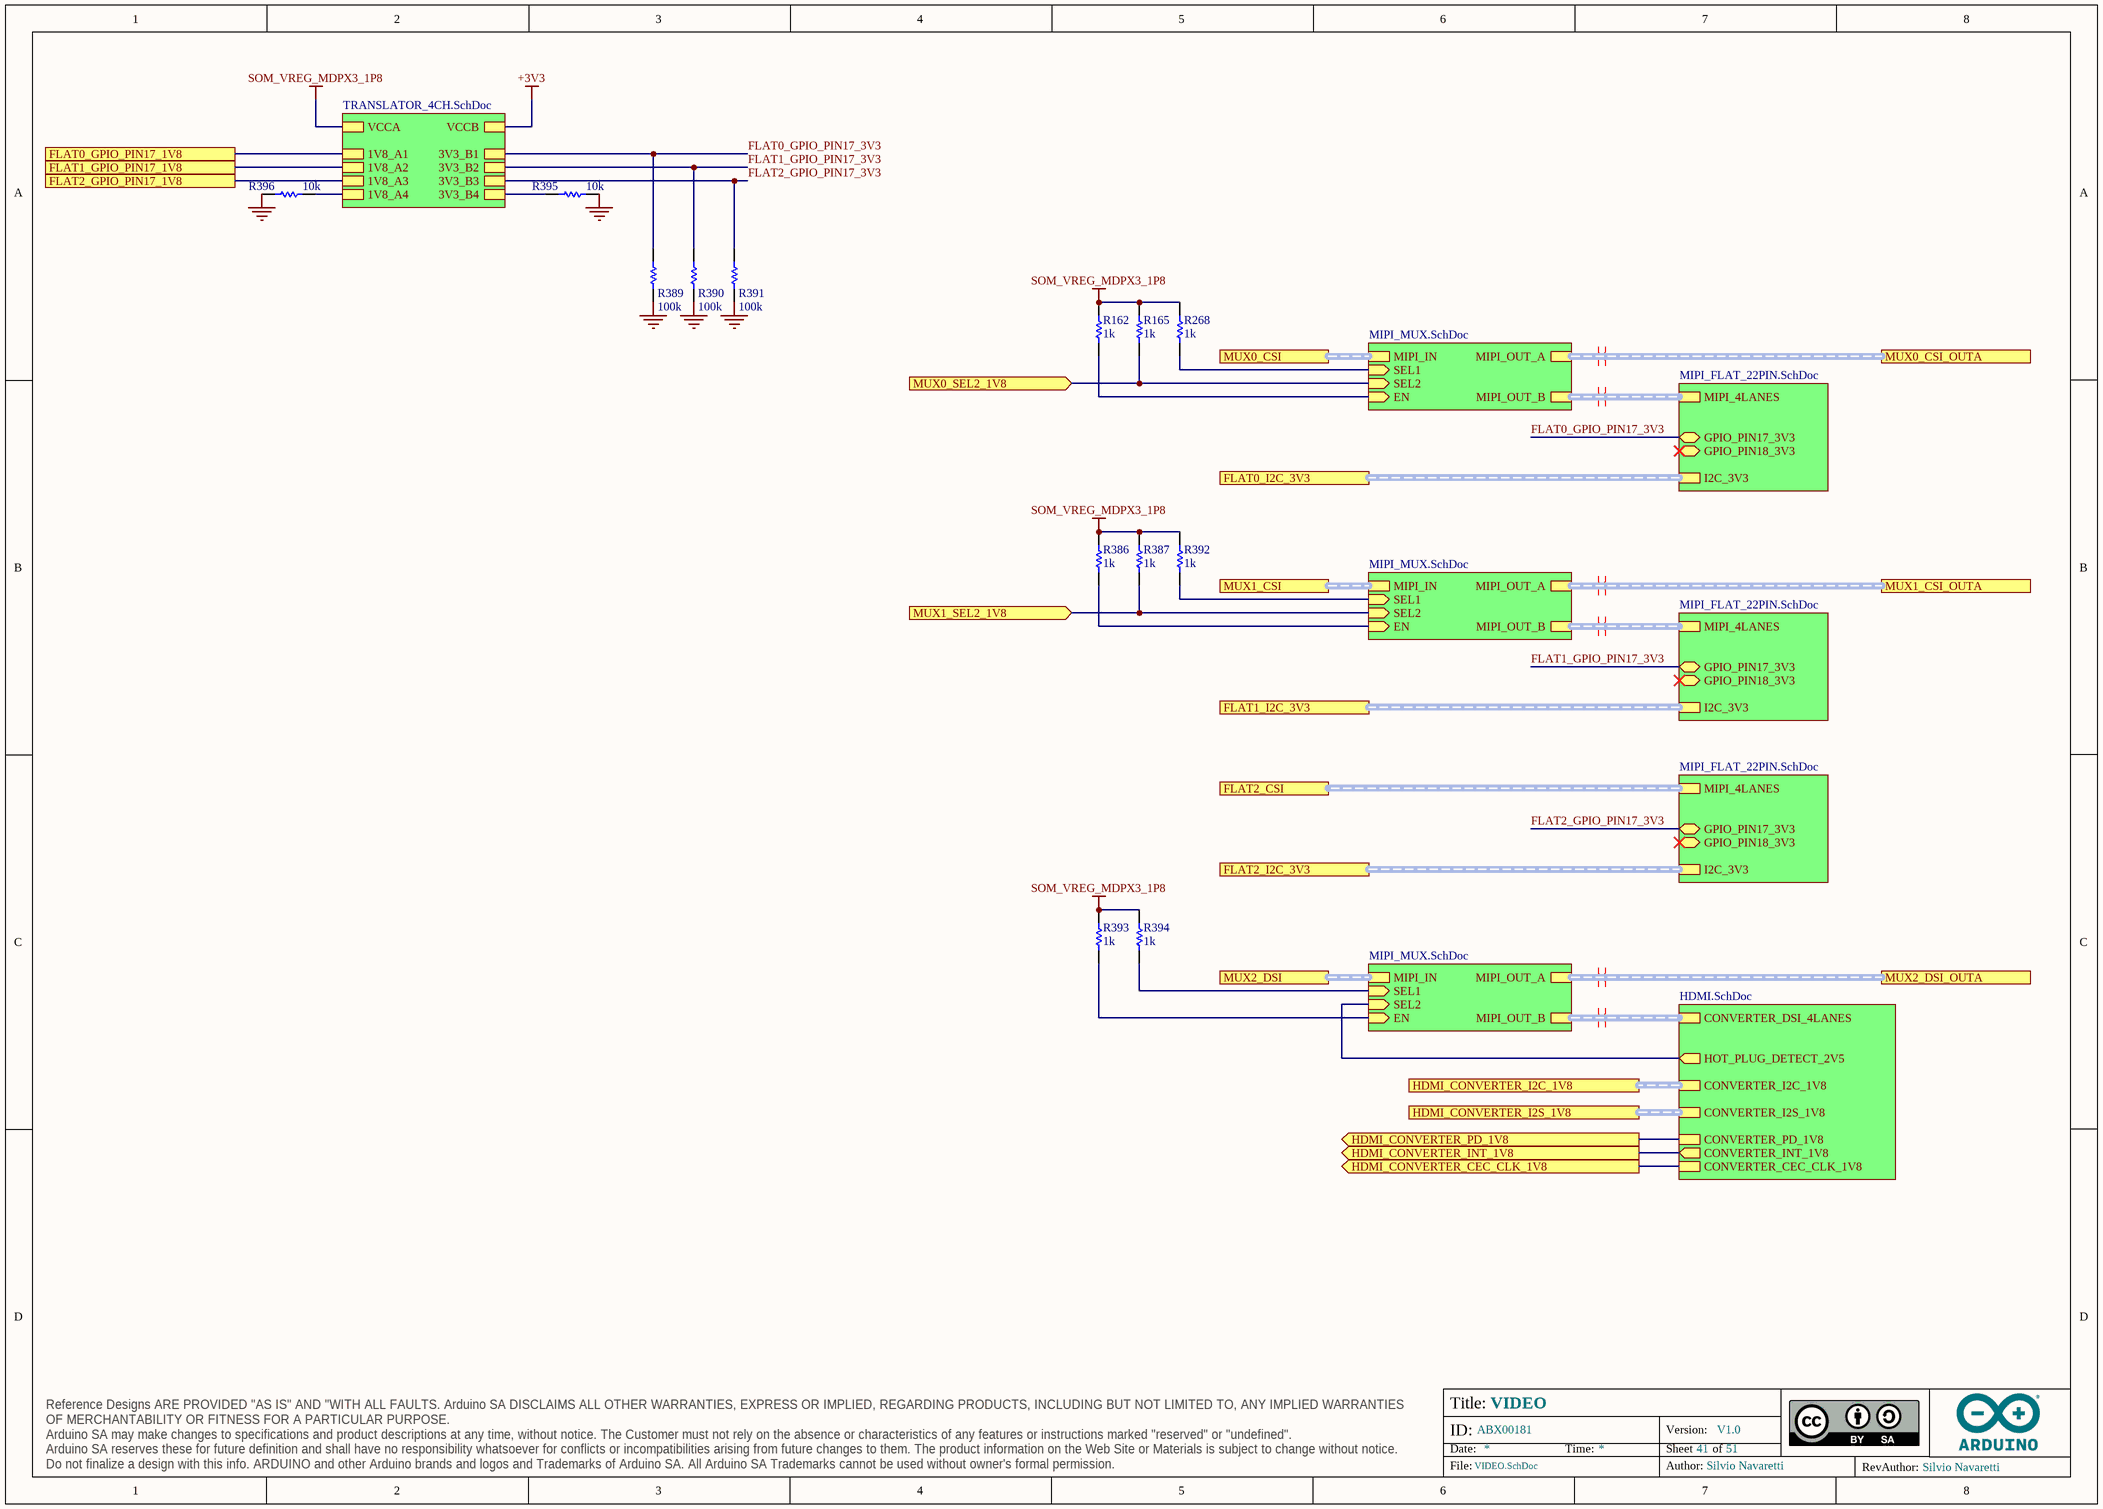
[diagram p28: VIDEO.SchDoc]

### Parts
R162  value 1k  [RES-0201]  (hidden comment: RC0201FR-071KL)
R165  value 1k  [RES-0201]  (hidden comment: RC0201FR-071KL)
R268  value 1k  [RES-0201]  (hidden comment: RC0201FR-071KL)
R386  value 1k  [RES-0201]  (hidden comment: RC0201FR-071KL)
R387  value 1k  [RES-0201]  (hidden comment: RC0201FR-071KL)
R389  value 100k  [RES-0201]  (hidden comment: RC0201FR-07100KL)
R390  value 100k  [RES-0201]  (hidden comment: RC0201FR-07100KL)
R391  value 100k  [RES-0201]  (hidden comment: RC0201FR-07100KL)
R392  value 1k  [RES-0201]  (hidden comment: RC0201FR-071KL)
R393  value 1k  [RES-0201]  (hidden comment: RC0201FR-071KL)
R394  value 1k  [RES-0201]  (hidden comment: RC0201FR-071KL)
R395  value 10k  [RES-0201]  (hidden comment: RC0201FR-0710KL)
R396  value 10k  [RES-0201]  (hidden comment: RC0201FR-0710KL)

### Sub-sheets
U_HDMI = HDMI.SchDoc: HOT_PLUG_DETECT_2V5 (out), CONVERTER_DSI_4LANES (harness MIPI_4LANES), CONVERTER_I2S_1V8 (harness MIPI_4LANES), CONVERTER_PD_1V8, CONVERTER_INT_1V8 (out), CONVERTER_CEC_CLK_1V8, CONVERTER_I2C_1V8 (harness MIPI_4LANES)
U_MIPI_FLAT_22PIN = MIPI_FLAT_22PIN.SchDoc: MIPI_4LANES (harness MIPI_4LANES), I2C_3V3 (harness I2C), GPIO_PIN17_3V3 (bidir), GPIO_PIN18_3V3 (bidir)
U_MIPI_FLAT_22PIN = MIPI_FLAT_22PIN.SchDoc: MIPI_4LANES (harness MIPI_4LANES), I2C_3V3 (harness I2C), GPIO_PIN17_3V3 (bidir), GPIO_PIN18_3V3 (bidir)
U_MIPI_FLAT_22PIN = MIPI_FLAT_22PIN.SchDoc: MIPI_4LANES (harness MIPI_4LANES), I2C_3V3 (harness I2C), GPIO_PIN17_3V3 (bidir), GPIO_PIN18_3V3 (bidir)
U_MIPI_MUX = MIPI_MUX.SchDoc: MIPI_OUT_A (harness MIPI_4LANES), MIPI_OUT_B (harness MIPI_4LANES), MIPI_IN (harness MIPI_4LANES), EN (in), SEL1 (in), SEL2 (in)
U_MIPI_MUX = MIPI_MUX.SchDoc: MIPI_IN (harness MIPI_4LANES), MIPI_OUT_A (harness MIPI_4LANES), MIPI_OUT_B (harness MIPI_4LANES), EN (in), SEL1 (in), SEL2 (in)
U_MIPI_MUX = MIPI_MUX.SchDoc: MIPI_IN (harness MIPI_4LANES), MIPI_OUT_A (harness MIPI_4LANES), MIPI_OUT_B (harness MIPI_4LANES), EN (in), SEL1 (in), SEL2 (in)
U_TRANSLATOR_4CH = TRANSLATOR_4CH.SchDoc: 1V8_A1, 1V8_A2, 1V8_A3, 1V8_A4, 3V3_B1, 3V3_B2, 3V3_B3, 3V3_B4, VCCA, VCCB

### Ports
FLAT0_GPIO_PIN17_1V8, FLAT0_I2C_3V3, FLAT1_GPIO_PIN17_1V8, FLAT1_I2C_3V3, FLAT2_CSI, FLAT2_GPIO_PIN17_1V8, FLAT2_I2C_3V3, HDMI_CONVERTER_CEC_CLK_1V8 (out), HDMI_CONVERTER_I2C_1V8 (harness I2C), HDMI_CONVERTER_I2S_1V8 (harness I2C), HDMI_CONVERTER_INT_1V8 (out), HDMI_CONVERTER_PD_1V8 (out), MUX0_CSI, MUX0_CSI_OUTA, MUX0_SEL2_1V8 (in), MUX1_CSI, MUX1_CSI_OUTA, MUX1_SEL2_1V8 (in), MUX2_DSI, MUX2_DSI_OUTA

### Nets
GND: R389.2 R390.2 R391.2 R395.2 R396.1
SOM_VREG_MDPX3_1P8: R162.1 R165.2 R268.2 R386.1 R387.2 R392.2 R393.2 R394.2 ; sheet U_TRANSLATOR_4CH/VCCA
FLAT0_GPIO_PIN17_3V3: R389.1 ; sheet U_MIPI_FLAT_22PIN/GPIO_PIN17_3V3, sheet U_TRANSLATOR_4CH/3V3_B1
FLAT1_GPIO_PIN17_3V3: R390.1 ; sheet U_MIPI_FLAT_22PIN/GPIO_PIN17_3V3, sheet U_TRANSLATOR_4CH/3V3_B2
FLAT2_GPIO_PIN17_3V3: R391.1 ; sheet U_MIPI_FLAT_22PIN/GPIO_PIN17_3V3, sheet U_TRANSLATOR_4CH/3V3_B3
MD_GPIO_24: R165.1 ; port MUX0_SEL2_1V8, sheet U_MIPI_MUX/SEL2
MD_GPIO_41: R387.1 ; port MUX1_SEL2_1V8, sheet U_MIPI_MUX/SEL2
MD_GPIO_64: port FLAT0_GPIO_PIN17_1V8, sheet U_TRANSLATOR_4CH/1V8_A1
MD_GPIO_75: port FLAT1_GPIO_PIN17_1V8, sheet U_TRANSLATOR_4CH/1V8_A2
MD_GPIO_82: port FLAT2_GPIO_PIN17_1V8, sheet U_TRANSLATOR_4CH/1V8_A3
MD_GPIO_93: port HDMI_CONVERTER_INT_1V8, sheet U_HDMI/CONVERTER_INT_1V8
NetR112_1: sheet U_HDMI/HOT_PLUG_DETECT_2V5, sheet U_MIPI_MUX/SEL2
NetR162_2: R162.2 ; sheet U_MIPI_MUX/EN
NetR268_1: R268.1 ; sheet U_MIPI_MUX/SEL1
NetR386_2: R386.2 ; sheet U_MIPI_MUX/EN
NetR392_1: R392.1 ; sheet U_MIPI_MUX/SEL1
NetR393_1: R393.1 ; sheet U_MIPI_MUX/EN
NetR394_1: R394.1 ; sheet U_MIPI_MUX/SEL1
NetR395_1: R395.1 ; sheet U_TRANSLATOR_4CH/3V3_B4
NetR396_2: R396.2 ; sheet U_TRANSLATOR_4CH/1V8_A4
NetU22_C3: port HDMI_CONVERTER_PD_1V8, sheet U_HDMI/CONVERTER_PD_1V8
NetU22_D7: port HDMI_CONVERTER_CEC_CLK_1V8, sheet U_HDMI/CONVERTER_CEC_CLK_1V8

### Buses and harness runs
harness port FLAT0_I2C_3V3 = sheet U_MIPI_FLAT_22PIN/I2C_3V3
harness port FLAT1_I2C_3V3 = sheet U_MIPI_FLAT_22PIN/I2C_3V3
harness port FLAT2_CSI = sheet U_MIPI_FLAT_22PIN/MIPI_4LANES
harness port FLAT2_I2C_3V3 = sheet U_MIPI_FLAT_22PIN/I2C_3V3
harness port HDMI_CONVERTER_I2C_1V8 = sheet U_HDMI/CONVERTER_I2C_1V8
harness port HDMI_CONVERTER_I2S_1V8 = sheet U_HDMI/CONVERTER_I2S_1V8
harness port MUX0_CSI = sheet U_MIPI_MUX/MIPI_IN
harness port MUX0_CSI_OUTA = sheet U_MIPI_MUX/MIPI_OUT_A
harness port MUX1_CSI = sheet U_MIPI_MUX/MIPI_IN
harness port MUX1_CSI_OUTA = sheet U_MIPI_MUX/MIPI_OUT_A
harness port MUX2_DSI = sheet U_MIPI_MUX/MIPI_IN
harness port MUX2_DSI_OUTA = sheet U_MIPI_MUX/MIPI_OUT_A
harness sheet U_HDMI/CONVERTER_DSI_4LANES = sheet U_MIPI_MUX/MIPI_OUT_B
harness sheet U_MIPI_FLAT_22PIN/MIPI_4LANES = sheet U_MIPI_MUX/MIPI_OUT_B

### Layout directives
differential pair; differential pair class DIFF_MUX0_OUTA; net class NET_DIFF_CSI_DSI: (no net found under the mark)
differential pair; differential pair class DIFF_MUX0_OUTB; net class NET_DIFF_CSI_DSI: (no net found under the mark)
differential pair; differential pair class DIFF_MUX1_OUTA; net class NET_DIFF_CSI_DSI: (no net found under the mark)
differential pair; differential pair class DIFF_MUX1_OUTB; net class NET_DIFF_CSI_DSI: (no net found under the mark)
differential pair; differential pair class DIFF_MUX2_OUTB; net class NET_DIFF_CSI_DSI: (no net found under the mark)
differential pair; differential pair class DIFF_MUX2_OUTA; net class NET_DIFF_CSI_DSI: (no net found under the mark)

### Notes on the sheet
- Title:
- ID:
- Date:
- Time:
- Version:
- Sheet
- of
- RevAuthor:
- Reference Designs ARE PROVIDED "AS IS" AND "WITH ALL FAULTS. Arduino SA DISCLAIMS ALL OTHER WARRANTIES, EXPRESS OR IMPLIED, REGARDING PRODUCTS, INCLUDING BUT NOT LIMITED TO, ANY IMPLIED WARRANTIES OF MERCHANTABILITY OR FITNESS FOR A PARTICULAR PURPOSE.
  Arduino SA may make changes to specifications and product descriptions at any time, without notice. The Customer must not rely on the absence or characteristics of any features or instructions marked "reserved" or "undefined".
  Arduino SA reserves these for future definition and shall have no responsibility whatsoever for conflicts or incompatibilities arising from future changes to them. The product information on the Web Site or Materials is subject to change without notice.
  Do not finalize a design with this info. ARDUINO and other Arduino brands and logos and Trademarks of Arduino SA. All Arduino SA Trademarks cannot be used without owner's formal permission.
- File:
- Author:

### Library data of the parts
R162 R165 R268 R386 R387 R392-R394 = R0195-A.22: as R270 on sheet AUDIO_CODEC; Tolerance: 1%; Case Code (Imperial): 0201; Part Number: RC0201FR-071KL; Technology: Thick film
R389-R391 = R0146-A.21: RES CHIP 0201 100k 1% 1/20W; Manufacturer: Yageo; Power: 50mW; Temperature coefficient: 200ppm; Code Arduino: R0146; Manufacturer 2: Samsung Electro-Mechanics; Tolerance: 1%; Case Code (Imperial): 0201; Part Number: RC0201FR-07100KL; Technology: Thick film
R395 R396 = R0145-A.21: as R122 on sheet HEADERS_JHAT; Manufacturer 2: Samsung Electro-Mechanics; Tolerance: 1%; Case Code (Imperial): 0201; Part Number: RC0201FR-0710KL; Technology: Thick film

## Sheet HDMI.SchDoc: HDMI
size A3; Author: Silvio Navaretti; CompanyName: ARDUINO; DrawnBy: Silvio Navaretti; Engineer: Silvio Navaretti; Organization: ARDUINO; SheetNumber: 43; SheetTotal: 50; RevAuthor: Silvio Navaretti
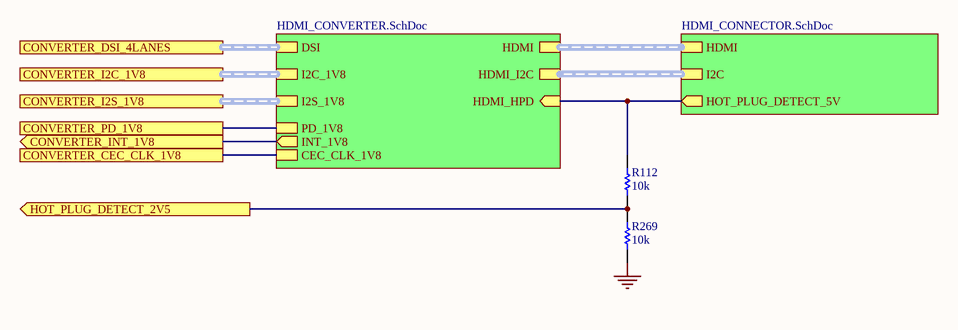
[diagram p29: HDMI.SchDoc]

### Parts
R112  value 10k  [RES-0201]  (hidden comment: RC0201FR-0710KL)
R269  value 10k  [RES-0201]  (hidden comment: RC0201FR-0710KL)

### Sub-sheets
U_HDMI_CONNECTOR = HDMI_CONNECTOR.SchDoc: HDMI (harness HDMI), I2C (harness I2C), HOT_PLUG_DETECT_5V (out)
U_HDMI_CONVERTER = HDMI_CONVERTER.SchDoc: DSI (harness MIPI_4LANES), HDMI_I2C (harness I2C), HDMI (harness HDMI), HDMI_HPD (in), I2C_1V8 (harness I2C), I2S_1V8 (harness SOM_MD_I2S), PD_1V8, INT_1V8 (out), CEC_CLK_1V8

### Ports
CONVERTER_CEC_CLK_1V8, CONVERTER_DSI_4LANES (harness MIPI_4LANES), CONVERTER_I2C_1V8 (harness MIPI_4LANES), CONVERTER_I2S_1V8 (harness MIPI_4LANES), CONVERTER_INT_1V8 (out), CONVERTER_PD_1V8, HOT_PLUG_DETECT_2V5 (out)

### Nets
GND: R269.1
MD_GPIO_93: port CONVERTER_INT_1V8, sheet U_HDMI_CONVERTER/INT_1V8
NetD16_4: R112.2 ; sheet U_HDMI_CONNECTOR/HOT_PLUG_DETECT_5V, sheet U_HDMI_CONVERTER/HDMI_HPD
NetR112_1: R112.1 R269.2 ; port HOT_PLUG_DETECT_2V5
NetU22_C3: port CONVERTER_PD_1V8, sheet U_HDMI_CONVERTER/PD_1V8
NetU22_D7: port CONVERTER_CEC_CLK_1V8, sheet U_HDMI_CONVERTER/CEC_CLK_1V8

### Buses and harness runs
harness port CONVERTER_DSI_4LANES = sheet U_HDMI_CONVERTER/DSI
harness port CONVERTER_I2C_1V8 = sheet U_HDMI_CONVERTER/I2C_1V8
harness port CONVERTER_I2S_1V8 = sheet U_HDMI_CONVERTER/I2S_1V8
harness sheet U_HDMI_CONNECTOR/HDMI = sheet U_HDMI_CONVERTER/HDMI
harness sheet U_HDMI_CONNECTOR/I2C = sheet U_HDMI_CONVERTER/HDMI_I2C

### Notes on the sheet
- Title:
- ID:
- Date:
- Time:
- Version:
- Sheet
- of
- RevAuthor:
- Reference Designs ARE PROVIDED "AS IS" AND "WITH ALL FAULTS. Arduino SA DISCLAIMS ALL OTHER WARRANTIES, EXPRESS OR IMPLIED, REGARDING PRODUCTS, INCLUDING BUT NOT LIMITED TO, ANY IMPLIED WARRANTIES OF MERCHANTABILITY OR FITNESS FOR A PARTICULAR PURPOSE.
  Arduino SA may make changes to specifications and product descriptions at any time, without notice. The Customer must not rely on the absence or characteristics of any features or instructions marked "reserved" or "undefined".
  Arduino SA reserves these for future definition and shall have no responsibility whatsoever for conflicts or incompatibilities arising from future changes to them. The product information on the Web Site or Materials is subject to change without notice.
  Do not finalize a design with this info. ARDUINO and other Arduino brands and logos and Trademarks of Arduino SA. All Arduino SA Trademarks cannot be used without owner's formal permission.
- File:
- Author:

### Library data of the parts
R112 R269 = R0145-A.21: as R122 on sheet HEADERS_JHAT; Manufacturer 2: Samsung Electro-Mechanics; Tolerance: 1%; Case Code (Imperial): 0201; Part Number: RC0201FR-0710KL; Technology: Thick film

## Sheet HDMI_CONNECTOR.SchDoc: HDMI CONNECTOR
size A3; Author: Silvio Navaretti; CompanyName: ARDUINO; DrawnBy: Silvio Navaretti; Engineer: Silvio Navaretti; Organization: ARDUINO; SheetNumber: 46; SheetTotal: 51; RevAuthor: Silvio Navaretti
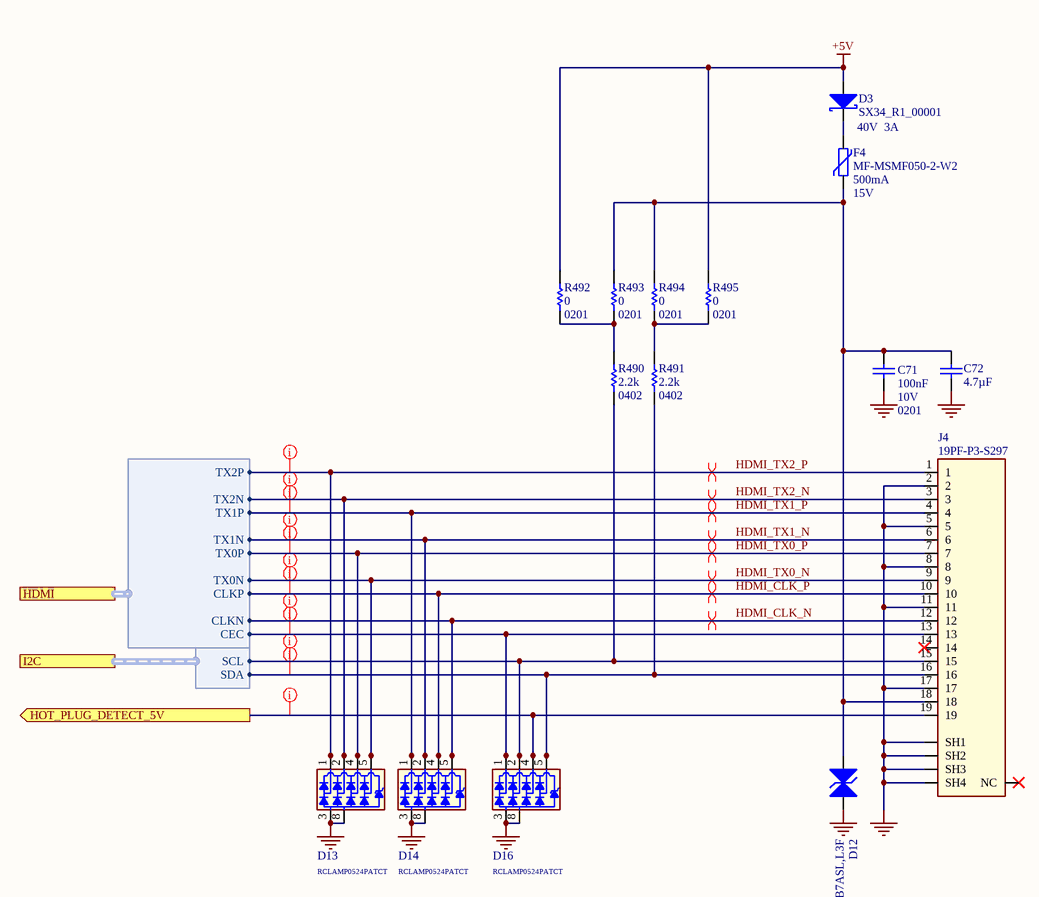
[diagram p30: HDMI_CONNECTOR.SchDoc]

### Parts
C71  value 100nF  Voltage: 10V  Case Code (Imperial): 0201  [CAP-0201]  (hidden comment: CL03A104KP3NNNC)
C72  value 4.7µF  [CAP-0402]  (hidden comment: C1005A475M6R3NT)
D3  SX34_R1_00001  Max Reverse Voltage (DC): 40V  Forward Current: 3A  [SMA DO214AC]
D12  DF2B7ASL,L3F  [DF2B7ASL,L3F]
D13  RCLAMP0524PATCT  [SLP2510P8]
D14  RCLAMP0524PATCT  [SLP2510P8]
D16  RCLAMP0524PATCT  [SLP2510P8]
F4  MF-MSMF050-2-W2  Hold Current: 500mA  Operating Supply Voltage: 15V  [1812]
J4  19PF-P3-S297  [19PF-P3-S297]
R490  value 2.2k  Case Code (Imperial): 0402  [RES-0402]  (hidden comment: AF0402FR-072K2L)
R491  value 2.2k  Case Code (Imperial): 0402  [RES-0402]  (hidden comment: AF0402FR-072K2L)
R492  value 0  Case Code (Imperial): 0201  [RES-0201]  (hidden comment: CRCW02010000Z0ED)
R493  value 0  Case Code (Imperial): 0201  [RES-0201]  (hidden comment: CRCW02010000Z0ED)
R494  value 0  Case Code (Imperial): 0201  [RES-0201]  (hidden comment: CRCW02010000Z0ED)
R495  value 0  Case Code (Imperial): 0201  [RES-0201]  (hidden comment: CRCW02010000Z0ED)

### Ports
HDMI (harness HDMI), HOT_PLUG_DETECT_5V (out), I2C (harness I2C)

### Harnesses
HDMI: TX2P, TX2N, TX1P, TX1N, TX0P, TX0N, CLKP, CLKN, CEC
I2C: SDA, SCL

### Nets
+5V: D3.A R492.2 R495.2
GND: C71.1 C72.1 D12.1(A1) D13.3 D13.8 D14.3 D14.8 D16.3 D16.8 J4.2 J4.5 J4.8 J4.11 J4.17 J4.SH1 J4.SH2 J4.SH3 J4.SH4
HDMI_CLK_N: D14.5 D14.6 J4.12 ; port HDMI.CLKN
HDMI_CLK_P: D14.4 D14.7 J4.10 ; port HDMI.CLKP
HDMI_TX0_N: D13.5 D13.6 J4.9 ; port HDMI.TX0N
HDMI_TX0_P: D13.4 D13.7 J4.7 ; port HDMI.TX0P
HDMI_TX1_N: D14.2 D14.9 J4.6 ; port HDMI.TX1N
HDMI_TX1_P: D14.1 D14.10 J4.4 ; port HDMI.TX1P
HDMI_TX2_N: D13.2 D13.9 J4.3 ; port HDMI.TX2N
HDMI_TX2_P: D13.1 D13.10 J4.1 ; port HDMI.TX2P
NetC71_2: C71.2 C72.2 D12.2(A2) F4.1 J4.18 R493.2 R494.2
NetD3_C: D3.C F4.2
NetD16_1: D16.1 D16.10 J4.13 ; port HDMI.CEC
NetD16_2: D16.2 D16.9 J4.15 R490.2 ; port I2C.SCL
NetD16_4: D16.4 D16.7 J4.19 ; port HOT_PLUG_DETECT_5V
NetD16_5: D16.5 D16.6 J4.16 R491.2 ; port I2C.SDA
NetR490_1: R490.1 R492.1 R493.1
NetR491_1: R491.1 R494.1 R495.1

Not connected (* = marked no-connect by the designer): J4 14* NC*

### Layout directives
net class NET_HDMI: HDMI_CLK_N, HDMI_CLK_P, HDMI_TX0_N, HDMI_TX0_P, HDMI_TX1_N, HDMI_TX1_P, HDMI_TX2_N, HDMI_TX2_P, NetD16_1, NetD16_2, NetD16_4, NetD16_5
differential pair; differential pair class DIFF_HDMI; net class NET_DIFF_HDMI: HDMI_CLK_N, HDMI_CLK_P, HDMI_TX0_N, HDMI_TX0_P, HDMI_TX1_N, HDMI_TX1_P, HDMI_TX2_N, HDMI_TX2_P

### Notes on the sheet
- Title:
- ID:
- Date:
- Time:
- Version:
- Sheet
- of
- RevAuthor:
- Reference Designs ARE PROVIDED "AS IS" AND "WITH ALL FAULTS. Arduino SA DISCLAIMS ALL OTHER WARRANTIES, EXPRESS OR IMPLIED, REGARDING PRODUCTS, INCLUDING BUT NOT LIMITED TO, ANY IMPLIED WARRANTIES OF MERCHANTABILITY OR FITNESS FOR A PARTICULAR PURPOSE.
  Arduino SA may make changes to specifications and product descriptions at any time, without notice. The Customer must not rely on the absence or characteristics of any features or instructions marked "reserved" or "undefined".
  Arduino SA reserves these for future definition and shall have no responsibility whatsoever for conflicts or incompatibilities arising from future changes to them. The product information on the Web Site or Materials is subject to change without notice.
  Do not finalize a design with this info. ARDUINO and other Arduino brands and logos and Trademarks of Arduino SA. All Arduino SA Trademarks cannot be used without owner's formal permission.
- File:
- Author:

### Library data of the parts
C71 = C0113-A.6: as C134 on sheet AUDIO_CODEC; Technology: Ceramic; Part Number: CL03A104KP3NNNC; Dielectric: X5R; Tolerance: 10%
C72 = C0037-A.14: CAP CHIP 0402 4.7uF 20% 6V3 X5R; Manufacturer: Hottech; Code Arduino: 0833; Voltage: 6.3V; Dielectric: X5R; Technology: Ceramic; Part Number: C1005A475M6R3NT; Manufacturer 2: Samsung Electro-Mechanics; Case Code (Imperial): 0402; Tolerance: 20%; Manufacturer 3: Murata Electronics; Part number 3: GRM155R60J475ME47D; Part number 2: CL05A475KQ5NRNC
D3 = D0109-A.2: DIODE SCHOTTKY SMD 3A 40V SMA DO214AC; Part Number: SX34-AU_R1_000A1; Manufacturer: Panjit; Code Arduino: D0109; Forward Voltage: 0.39V; Device Type: Diode Schottky
D12 = D0099-5: TVS BIDIRECTIONAL SMD Vr 5.5V, Vbr min 5.8V, 0.62x0.32mm; Manufacturer: TOSHIBA; Vforward max: 0V; Ireverse max: 1µA; Power max: 80W; Code Arduino: D0099; Vreverse max: 20V; V(BR) min: 5.8V; V(RWM) max: 5.5V; Part Number: DF2B7ASL,L3F
D13 D14 D16 = D0097-A.6: TVS UNIDIRECTIONAL 4CH 0.8pF 5V SLP2510P8 10-pin 2.5x1.0x0.58mm; Manufacturer: SEMTECH; Code Arduino: D0097; Device Type: ESD protection; Part Number: RCLAMP0524PATCT
F4 = P0002-A.7: PTC RESET FUSE 15V 500MA 1812 LOGO OO ARDUINO; Manufacturer: Bourns; Approvals: UL,CSA,TUV; Time to Trip: 0.15s; Max Current Rating: 100A; Trip Current: 1A; Resistance: 150mR; Code Arduino: 3335; Power Dissipation: 800mW; Part Number: MF-MSMF050-2-W2; Contact Plating: Gold; Case Code (Metric): 4532; Min Operating Temperature: -40°C; Packaging: Tape and Reel; Max Operating Temperature: 85°C; Radiation Hardening: No; Voltage Rating (DC): 15V; Termination: SMD/SMT; Number of Terminals: 2; Terminal Material: Gold; Voltage Rating: 15V; Width: 3.41mm; Case Code (Imperial): 1812; Length: 4.73mm; Current Rating: 100A; REACH SVHC: No SVHC; Package Quantity: 2000; Lead Free: Lead Free; Case/Package: 1812; Height: 0.85mm; Mount: Surface Mount,PCB
J4 = J0578-A.2: CONN HDMI RIGHT ANGLE FEMALE 19 POSITIONS 7.75x23.06x16.4mm signals pins lengths 2.3mm; Manufacturer: Contact technology; Code Arduino: J0578; Part Number: 19PF-P3-S297
R490 R491 = R0286-A.3: RES CHIP 0402 2k2 1% 1/16W; Manufacturer: Yageo; Power: 62.5mW; Temperature coefficient: 100ppm; Code Arduino: R0286; Part Number 2: RI0402L2201FT; Technology: Thick film; Tolerance: 1%; Part Number: AF0402FR-072K2L; Manufacturer 2: Hottech
R492-R495 = R0140-A.21: as R277-R283 on sheet AUDIO_CODEC; Technology: Thick film; Part Number: CRCW02010000Z0ED

## Sheet HDMI_CONVERTER.SchDoc: HDMI CONVERTER
size A3; Author: Silvio Navaretti; CompanyName: ARDUINO; DrawnBy: Silvio Navaretti; Engineer: Silvio Navaretti; Organization: ARDUINO; SheetNumber: 44; SheetTotal: 50; RevAuthor: Silvio Navaretti
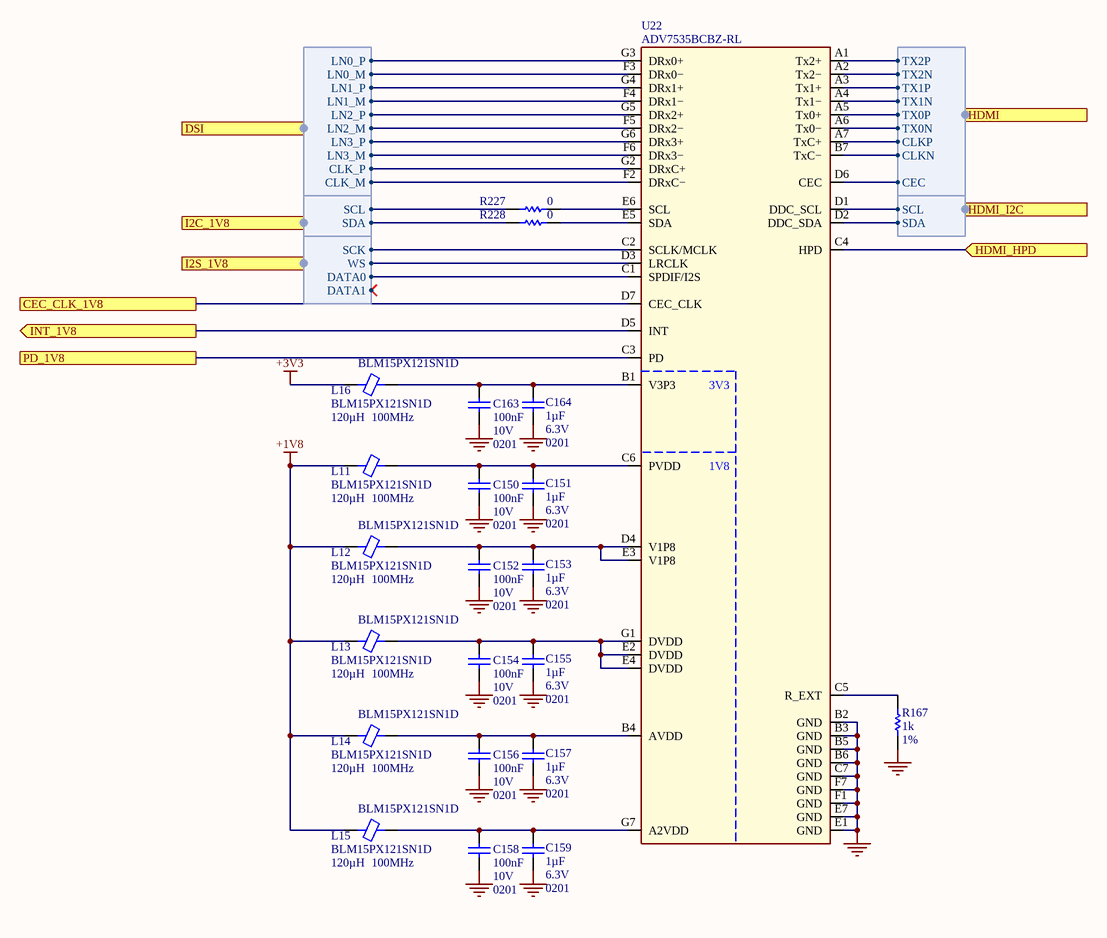
[diagram p31: HDMI_CONVERTER.SchDoc]

### Parts
C150  value 100nF  Voltage: 10V  Case Code (Imperial): 0201  [CAP-0201]  (hidden comment: CL03A104KP3NNNC)
C151  value 1µF  Voltage: 6.3V  Case Code (Imperial): 0201  [CAP-0201]  (hidden comment: GRM033R60J105MEA2D)
C152  value 100nF  Voltage: 10V  Case Code (Imperial): 0201  [CAP-0201]  (hidden comment: CL03A104KP3NNNC)
C153  value 1µF  Voltage: 6.3V  Case Code (Imperial): 0201  [CAP-0201]  (hidden comment: GRM033R60J105MEA2D)
C154  value 100nF  Voltage: 10V  Case Code (Imperial): 0201  [CAP-0201]  (hidden comment: CL03A104KP3NNNC)
C155  value 1µF  Voltage: 6.3V  Case Code (Imperial): 0201  [CAP-0201]  (hidden comment: GRM033R60J105MEA2D)
C156  value 100nF  Voltage: 10V  Case Code (Imperial): 0201  [CAP-0201]  (hidden comment: CL03A104KP3NNNC)
C157  value 1µF  Voltage: 6.3V  Case Code (Imperial): 0201  [CAP-0201]  (hidden comment: GRM033R60J105MEA2D)
C158  value 100nF  Voltage: 10V  Case Code (Imperial): 0201  [CAP-0201]  (hidden comment: CL03A104KP3NNNC)
C159  value 1µF  Voltage: 6.3V  Case Code (Imperial): 0201  [CAP-0201]  (hidden comment: GRM033R60J105MEA2D)
C163  value 100nF  Voltage: 10V  Case Code (Imperial): 0201  [CAP-0201]  (hidden comment: CL03A104KP3NNNC)
C164  value 1µF  Voltage: 6.3V  Case Code (Imperial): 0201  [CAP-0201]  (hidden comment: GRM033R60J105MEA2D)
L11  BLM15PX121SN1D  Inductance: 120µH  Test Frequency: 100MHz  [L-0402]
L12  BLM15PX121SN1D  Inductance: 120µH  Test Frequency: 100MHz  [L-0402]
L13  BLM15PX121SN1D  Inductance: 120µH  Test Frequency: 100MHz  [L-0402]
L14  BLM15PX121SN1D  Inductance: 120µH  Test Frequency: 100MHz  [L-0402]
L15  BLM15PX121SN1D  Inductance: 120µH  Test Frequency: 100MHz  [L-0402]
L16  BLM15PX121SN1D  Inductance: 120µH  Test Frequency: 100MHz  [L-0402]
R167  value 1k  Tolerance: 1%  [RES-0201]  (hidden comment: RC0201FR-071KL)
R227  value 0  [RES-0201]  (hidden comment: CRCW02010000Z0ED)
R228  value 0  [RES-0201]  (hidden comment: CRCW02010000Z0ED)
U22  ADV7535BCBZ-RL  [Analog Devices CB-49-1 WLCSP49 7x7 pitch 0.5mm 3.5x3.5mm]

### Ports
CEC_CLK_1V8, DSI (harness MIPI_4LANES), HDMI (harness HDMI), HDMI_HPD (in), HDMI_I2C (harness I2C), I2C_1V8 (harness I2C), I2S_1V8 (harness SOM_MD_I2S), INT_1V8 (out), PD_1V8

### Harnesses
I2C: SDA, SCL
MIPI_4LANES: LN3_M, LN2_M, LN2_P, LN0_M, LN0_P, CLK_M, CLK_P, LN1_M, LN1_P, LN3_P
HDMI: TX2P, TX2N, TX1P, TX1N, TX0P, TX0N, CLKP, CLKN, CEC
SOM_MD_I2S: SCK, WS, DATA0, DATA1

### Nets
+1V8: L11.1 L12.1 L13.1 L14.1 L15.1
+3V3: L16.1
GND: C150.1 C151.1 C152.1 C153.1 C154.1 C155.1 C156.1 C157.1 C158.1 C159.1 C163.1 C164.1 R167.1 U22.B2(GND) U22.B3(GND) U22.B5(GND) U22.B6(GND) U22.C7(GND) U22.E1(GND) U22.E7(GND) U22.F1(GND) U22.F7(GND)
B_CLK_N: U22.F2(DRxC−) ; port DSI.CLK_M
B_CLK_P: U22.G2(DRxC+) ; port DSI.CLK_P
B_LN0_N: U22.F3(DRx0−) ; port DSI.LN0_M
B_LN0_P: U22.G3(DRx0+) ; port DSI.LN0_P
B_LN1_N: U22.F4(DRx1−) ; port DSI.LN1_M
B_LN1_P: U22.G4(DRx1+) ; port DSI.LN1_P
B_LN2_N: U22.F5(DRx2−) ; port DSI.LN2_M
B_LN2_P: U22.G5(DRx2+) ; port DSI.LN2_P
B_LN3_N: U22.F6(DRx3−) ; port DSI.LN3_M
B_LN3_P: U22.G6(DRx3+) ; port DSI.LN3_P
HDMI_CLK_N: U22.B7(TxC−) ; port HDMI.CLKN
HDMI_CLK_P: U22.A7(TxC+) ; port HDMI.CLKP
HDMI_TX0_N: U22.A6(Tx0−) ; port HDMI.TX0N
HDMI_TX0_P: U22.A5(Tx0+) ; port HDMI.TX0P
HDMI_TX1_N: U22.A4(Tx1−) ; port HDMI.TX1N
HDMI_TX1_P: U22.A3(Tx1+) ; port HDMI.TX1P
HDMI_TX2_N: U22.A2(Tx2−) ; port HDMI.TX2N
HDMI_TX2_P: U22.A1(Tx2+) ; port HDMI.TX2P
MD_GPIO_45: R228.2 ; port I2C_1V8.SDA
MD_GPIO_46: R227.2 ; port I2C_1V8.SCL
MD_GPIO_93: U22.D5(INT) ; port INT_1V8
MD_LPASS_GPIO_125: U22.C2(SCLK/MCLK) ; port I2S_1V8.SCK
MD_LPASS_GPIO_126: U22.D3(LRCLK) ; port I2S_1V8.WS
MD_LPASS_GPIO_127: U22.C1(SPDIF/I2S) ; port I2S_1V8.DATA0
NetC150_2: C150.2 C151.2 L11.2 U22.C6(PVDD)
NetC152_2: C152.2 C153.2 L12.2 U22.D4(V1P8) U22.E3(V1P8)
NetC154_2: C154.2 C155.2 L13.2 U22.E2(DVDD) U22.E4(DVDD) U22.G1(DVDD)
NetC156_2: C156.2 C157.2 L14.2 U22.B4(AVDD)
NetC158_2: C158.2 C159.2 L15.2 U22.G7(A2VDD)
NetC163_2: C163.2 C164.2 L16.2 U22.B1(V3P3)
NetD16_1: U22.D6(CEC) ; port HDMI.CEC
NetD16_2: U22.D1(DDC_SCL) ; port HDMI_I2C.SCL
NetD16_4: U22.C4(HPD) ; port HDMI_HPD
NetD16_5: U22.D2(DDC_SDA) ; port HDMI_I2C.SDA
NetR167_2: R167.2 U22.C5(R_EXT)
NetR227_1: R227.1 U22.E6(SCL)
NetR228_1: R228.1 U22.E5(SDA)
NetU22_C3: U22.C3(PD) ; port PD_1V8
NetU22_D7: U22.D7(CEC_CLK) ; port CEC_CLK_1V8

### Notes on the sheet
- Title:
- ID:
- Date:
- Time:
- Version:
- Sheet
- of
- RevAuthor:
- Reference Designs ARE PROVIDED "AS IS" AND "WITH ALL FAULTS. Arduino SA DISCLAIMS ALL OTHER WARRANTIES, EXPRESS OR IMPLIED, REGARDING PRODUCTS, INCLUDING BUT NOT LIMITED TO, ANY IMPLIED WARRANTIES OF MERCHANTABILITY OR FITNESS FOR A PARTICULAR PURPOSE.
  Arduino SA may make changes to specifications and product descriptions at any time, without notice. The Customer must not rely on the absence or characteristics of any features or instructions marked "reserved" or "undefined".
  Arduino SA reserves these for future definition and shall have no responsibility whatsoever for conflicts or incompatibilities arising from future changes to them. The product information on the Web Site or Materials is subject to change without notice.
  Do not finalize a design with this info. ARDUINO and other Arduino brands and logos and Trademarks of Arduino SA. All Arduino SA Trademarks cannot be used without owner's formal permission.
- File:
- Author:
- (in symbol U0508-A.3) 3V3; 1V8

### Library data of the parts
C150 C152 C154 C156 C158 C163 = C0113-A.6: as C134 on sheet AUDIO_CODEC; Technology: Ceramic; Part Number: CL03A104KP3NNNC; Dielectric: X5R; Tolerance: 10%
C151 C153 C155 C157 C159 C164 = C0002-A.15: as C109 on sheet AUDIO_CODEC; Tolerance: 20%; Dielectric: X5R; Part Number: GRM033R60J105MEA2D; Technology: Ceramic
L11-L16 = I0028-A.10: as L17 on sheet AUDIO_CODEC; Device Type: Ferrite; Packaging: Tape and Reel; Case Code (Imperial): 0402; Max DC Current: 2A; Case Code (Metric): 1005; Package Quantity: 10000; Current: 2A; Max Operating Temperature: 125°C; Tolerance: 25%; Min Operating Temperature: -55°C; Part Number: BLM15PX121SN1D
R167 = R0195-A.22: as R270 on sheet AUDIO_CODEC; Part Number: RC0201FR-071KL; Case Code (Imperial): 0201; Technology: Thick film
R227 R228 = R0140-A.21: as R277-R283 on sheet AUDIO_CODEC; Technology: Thick film; Case Code (Imperial): 0201; Part Number: CRCW02010000Z0ED
U22 = U0508-A.3: IC DSI to HDMI converter, WLCSP49 3.5x3.5mm; Manufacturer: Analog Devices; Code Arduino: U0508; Part Number: ADV7535BCBZ-RL

## Sheet MIPI_MUX.SchDoc: MIPI MUX
size A3; Author: Silvio Navaretti; CompanyName: ARDUINO; DrawnBy: Silvio Navaretti; Engineer: Silvio Navaretti; Organization: ARDUINO; SheetNumber: 42; SheetTotal: 51; RevAuthor: Silvio Navaretti
Used 3 times, as channels U_MIPI/U_MIPI_MUX, U_MIPI/U_MIPI_MUX, U_MIPI/U_MIPI_MUX. Parts and nets are listed once, with the designators drawn on the sheet.
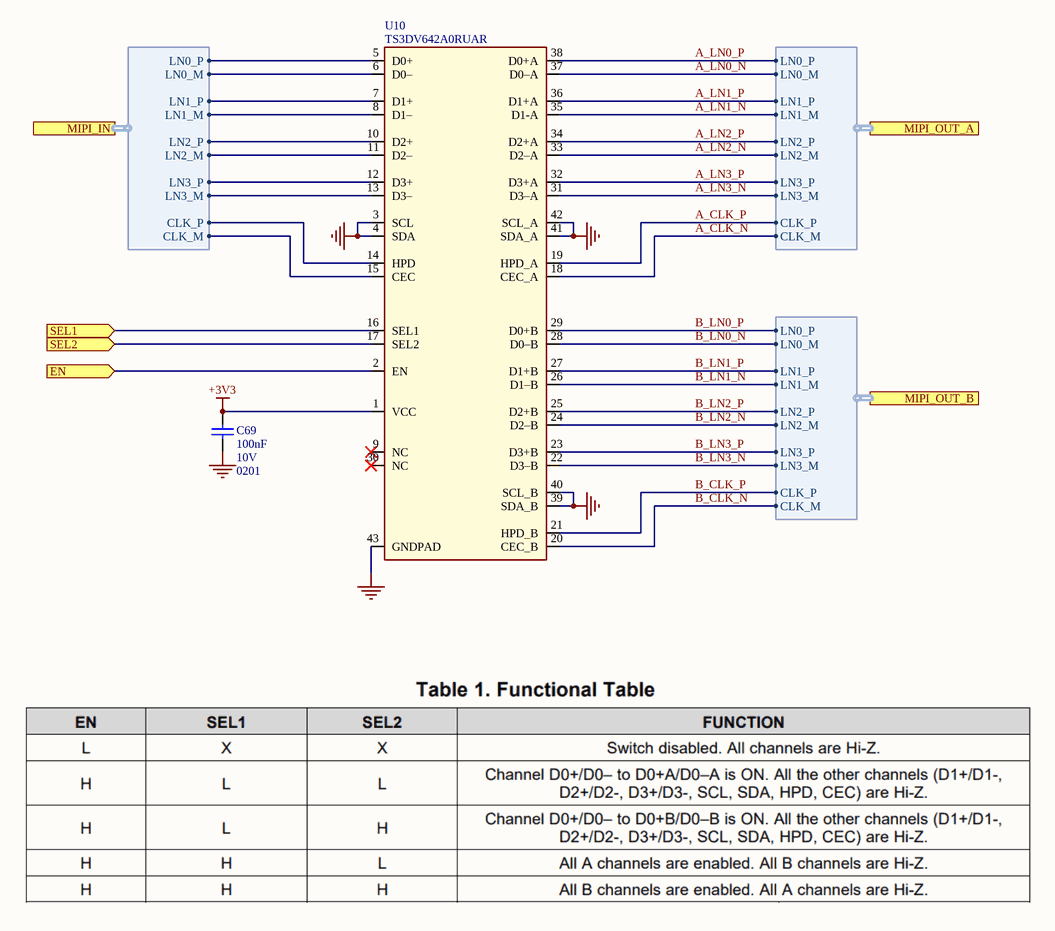
[diagram p32: MIPI_MUX.SchDoc]

### Parts
C69  value 100nF  Voltage: 10V  Case Code (Imperial): 0201  [CAP-0201]  (hidden comment: CL03A104KP3NNNC)
U10  TS3DV642A0RUAR  [TI RUA0042A WQFN 42 pin pitch 0.5mm 3.5x9mm]

### Ports
EN (in), MIPI_IN (harness MIPI_4LANES), MIPI_OUT_A (harness MIPI_4LANES), MIPI_OUT_B (harness MIPI_4LANES), SEL1 (in), SEL2 (in)

### Harnesses
MIPI_4LANES: LN3_M, LN2_M, LN2_P, LN0_M, LN0_P, CLK_M, CLK_P, LN1_M, LN1_P, LN3_P

### Nets
+3V3: C69.2 U10.1(VCC)
GND: C69.1 U10.3(SCL) U10.4(SDA) U10.39(SDA_B) U10.40(SCL_B) U10.41(SDA_A) U10.42(SCL_A) U10.43(GNDPAD)
A_CLK_N: U10.18(CEC_A) ; port MIPI_OUT_A.CLK_M
A_CLK_P: U10.19(HPD_A) ; port MIPI_OUT_A.CLK_P
A_LN0_N: U10.37(D0–A) ; port MIPI_OUT_A.LN0_M
A_LN0_P: U10.38(D0+A) ; port MIPI_OUT_A.LN0_P
A_LN1_N: U10.35(D1-A) ; port MIPI_OUT_A.LN1_M
A_LN1_P: U10.36(D1+A) ; port MIPI_OUT_A.LN1_P
A_LN2_N: U10.33(D2–A) ; port MIPI_OUT_A.LN2_M
A_LN2_P: U10.34(D2+A) ; port MIPI_OUT_A.LN2_P
A_LN3_N: U10.31(D3–A) ; port MIPI_OUT_A.LN3_M
A_LN3_P: U10.32(D3+A) ; port MIPI_OUT_A.LN3_P
B_CLK_N: U10.20(CEC_B) ; port MIPI_OUT_B.CLK_M
B_CLK_P: U10.21(HPD_B) ; port MIPI_OUT_B.CLK_P
B_LN0_N: U10.28(D0–B) ; port MIPI_OUT_B.LN0_M
B_LN0_P: U10.29(D0+B) ; port MIPI_OUT_B.LN0_P
B_LN1_N: U10.26(D1–B) ; port MIPI_OUT_B.LN1_M
B_LN1_P: U10.27(D1+B) ; port MIPI_OUT_B.LN1_P
B_LN2_N: U10.24(D2–B) ; port MIPI_OUT_B.LN2_M
B_LN2_P: U10.25(D2+B) ; port MIPI_OUT_B.LN2_P
B_LN3_N: U10.22(D3–B) ; port MIPI_OUT_B.LN3_M
B_LN3_P: U10.23(D3+B) ; port MIPI_OUT_B.LN3_P
EN: U10.2(EN) ; port EN
SEL1: U10.16(SEL1) ; port SEL1
SEL2: U10.17(SEL2) ; port SEL2
NetU10_5: U10.5(D0+) ; port MIPI_IN.LN0_P
NetU10_6: U10.6(D0–) ; port MIPI_IN.LN0_M
NetU10_7: U10.7(D1+) ; port MIPI_IN.LN1_P
NetU10_8: U10.8(D1–) ; port MIPI_IN.LN1_M
NetU10_10: U10.10(D2+) ; port MIPI_IN.LN2_P
NetU10_11: U10.11(D2–) ; port MIPI_IN.LN2_M
NetU10_12: U10.12(D3+) ; port MIPI_IN.LN3_P
NetU10_13: U10.13(D3–) ; port MIPI_IN.LN3_M
NetU10_14: U10.14(HPD) ; port MIPI_IN.CLK_P
NetU10_15: U10.15(CEC) ; port MIPI_IN.CLK_M

Not connected (* = marked no-connect by the designer): U10 9(NC)* 30(NC)*

### Channels
U_MIPI/U_MIPI_MUX: designators end in _1; ports EN=NetR393_1 SEL1=NetR394_1 SEL2=NetR112_1
U_MIPI/U_MIPI_MUX: designators end in _2; ports EN=NetR162_2 SEL1=NetR268_1 SEL2=MD_GPIO_24
U_MIPI/U_MIPI_MUX: designators end in _3; ports EN=NetR386_2 SEL1=NetR392_1 SEL2=MD_GPIO_41

### Notes on the sheet
- Title:
- ID:
- Date:
- Time:
- Version:
- Sheet
- of
- RevAuthor:
- Reference Designs ARE PROVIDED "AS IS" AND "WITH ALL FAULTS. Arduino SA DISCLAIMS ALL OTHER WARRANTIES, EXPRESS OR IMPLIED, REGARDING PRODUCTS, INCLUDING BUT NOT LIMITED TO, ANY IMPLIED WARRANTIES OF MERCHANTABILITY OR FITNESS FOR A PARTICULAR PURPOSE.
  Arduino SA may make changes to specifications and product descriptions at any time, without notice. The Customer must not rely on the absence or characteristics of any features or instructions marked "reserved" or "undefined".
  Arduino SA reserves these for future definition and shall have no responsibility whatsoever for conflicts or incompatibilities arising from future changes to them. The product information on the Web Site or Materials is subject to change without notice.
  Do not finalize a design with this info. ARDUINO and other Arduino brands and logos and Trademarks of Arduino SA. All Arduino SA Trademarks cannot be used without owner's formal permission.
- File:
- Author:

### Library data of the parts
C69 = C0113-A.6: as C134 on sheet AUDIO_CODEC; Technology: Ceramic; Part Number: CL03A104KP3NNNC; Dielectric: X5R; Tolerance: 10%
U10 = U0522-A.2: IC MUX SWITCH 6GHz, 12 channel 2:1 bidirectional switch, port A 6.9GHz port B 7.5GHz, Vcc 2.6V to 4.5V, WQFN42 9x3.5mm; Manufacturer: Texas Instruments; Code Arduino: U0522; Part Number: TS3DV642A0RUAR